# EAGLE design 2bitRegisterBoard (EAGLE 9.2.0)
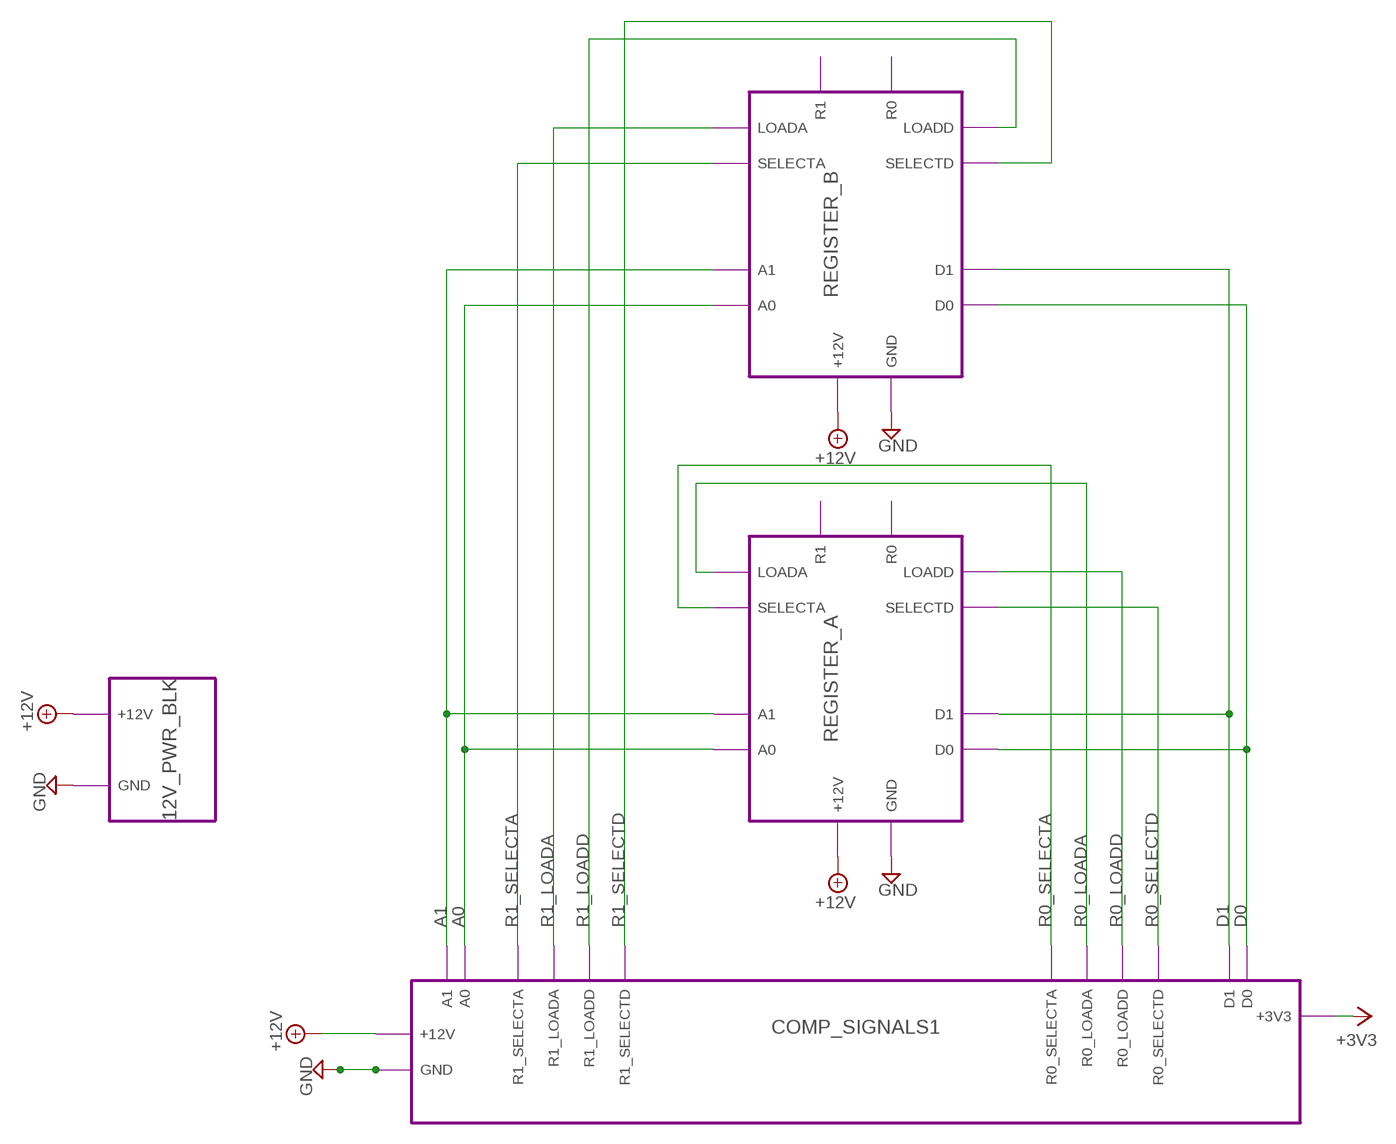
[diagram p0: schematic, sheet 1]

## Module instances
COMP_SIGNALS1 = COMP_SIGNALS
12V_PWR_BLK = 12V_PWR_BLK
REGISTER_A = REGISTER2
REGISTER_B = REGISTER2

## Nets
+3V3 [pwr]: port COMP_SIGNALS1.+3V3
+12V [pwr]: port 12V_PWR_BLK.+12V COMP_SIGNALS1.+12V REGISTER_A.+12V REGISTER_B.+12V
A0: port COMP_SIGNALS1.A0 REGISTER_B.A0 REGISTER_A.A0
A1: port COMP_SIGNALS1.A1 REGISTER_B.A1 REGISTER_A.A1
D0: port COMP_SIGNALS1.D0 REGISTER_B.D0 REGISTER_A.D0
D1: port COMP_SIGNALS1.D1 REGISTER_B.D1 REGISTER_A.D1
GND [pwr]: port 12V_PWR_BLK.GND COMP_SIGNALS1.GND REGISTER_A.GND REGISTER_B.GND
R0_LOADA: port REGISTER_A.LOADA COMP_SIGNALS1.R0_LOADA
R0_LOADD: port COMP_SIGNALS1.R0_LOADD REGISTER_A.LOADD
R0_SELECTA: port COMP_SIGNALS1.R0_SELECTA REGISTER_A.SELECTA
R0_SELECTD: port COMP_SIGNALS1.R0_SELECTD REGISTER_A.SELECTD
R1_LOADA: port COMP_SIGNALS1.R1_LOADA REGISTER_B.LOADA
R1_LOADD: port COMP_SIGNALS1.R1_LOADD REGISTER_B.LOADD
R1_SELECTA: port COMP_SIGNALS1.R1_SELECTA REGISTER_B.SELECTA
R1_SELECTD: port COMP_SIGNALS1.R1_SELECTD REGISTER_B.SELECTD

## Library data of the parts

## Module 3V3_TO_12V_1BIT
Ports: IN(in) OUT(out) +12V(pwr) GND(pwr)
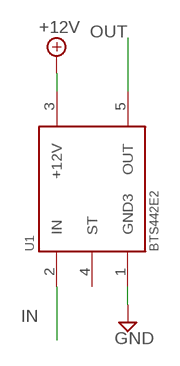
[diagram p1: schematic, module 3V3_TO_12V_1BIT, sheet 1]

### Parts
U1  BTS442E2  [TO170P440X1000X1975-5B]

### Nets
+12V: U1.3(+12V)
GND: U1.1(GND3)
IN: U1.2(IN)
OUT: U1.5(OUT)
Unconnected: U1.4(ST)

### Library data of the parts
U1 = relay_computer_custom:BTS442E2: BTS442E2 Smart High Side Power Switch, VBB 63V, R(ON) 18mOhm TO170P440X1000X1975-5B; MPN: BTS442E2BKSA1; OC_NEWARK: 78X4831

## Module 12V_PWR_BLK
Ports: +12V(pwr) GND(pwr)
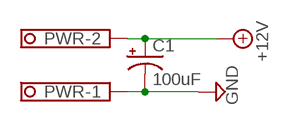
[diagram p2: schematic, module 12V_PWR_BLK, sheet 1]

### Parts
C1  100uF  100UF-POLAR-RADIAL-5MM-50V-20%  [CPOL-RADIAL-5MM-8MM]
PWR  PWR_BLK  [1751248]

### Nets
+12V: C1.1(+) PWR.2
GND: C1.2(-) PWR.1

### Library data of the parts
C1 = relay_computer_custom:100UF-POLAR: 100µF polarized capacitors A capacitor is a passive two-terminal electrical component used to store electrical energy temporarily in an electric field.; PROD_ID: ECA1HM101
PWR = relay_computer_custom:PWR_BLK: MKDS 1/ 2-3,5 Printklemme Nennstrom: 10 A Bemessungsspannung: 160 V Raster: 3,5 mm Polzahl: 2 Montageart: Löten Anschlussart: Schraubanschluss Anschlussrichtung vom Leiter zur Platine: 0° Source: http://eshop.phoenixcontact.com .. 1751248.pdf; OC_FARNELL: unknown; OC_NEWARK: unknown

## Module 12V_TO_3V3_1BIT
Ports: OUT(out) +3V3(pwr) GND(pwr) IN(in)
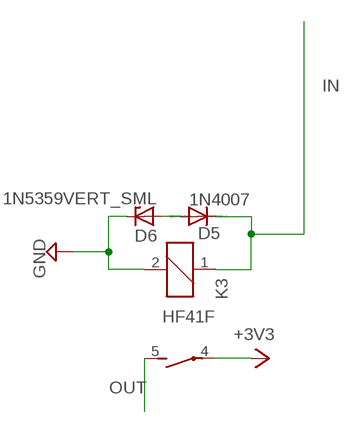
[diagram p3: schematic, module 12V_TO_3V3_1BIT, sheet 1]

### Parts
D5  1N4007  [RAD2,5]
D6  1N5359VERT_SML  [RAD2.5_D2]
K3  HF41F-12-H  [HF41F-12-H]

### Nets
+3V3: K3.4(P)
D$3: D5.A D6.A
GND: D6.C K3.2
IN: D5.C K3.1
OUT: K3.5(S)

### Notes on the sheet
- HF41F

### Library data of the parts
D5 = relay_computer_custom:1N4007: DIODE general purpose rectifier, 1 A; MPN: 1N4007-E3/73; OC_NEWARK: 78K2222
D6 = relay_computer_custom:1N5359: Z DIODE 24 V, 5W; MF: ON SEMICONDUCTOR; MPN: 1N5359BRLG; OC_NEWARK: 42K2893
K3 = relay_computer_custom:HF41F-12-H: SPST RELAY Relay SPST 5mm x 28mm HONGFA; OC_NEWARK: unknown

## Module DUAL_12V⇆3V3_1BIT
Ports: IN3V3(in) OUT3V3(out) +3V3(pwr) GND(pwr) +12V(pwr) 12V_SIGNAL(io)
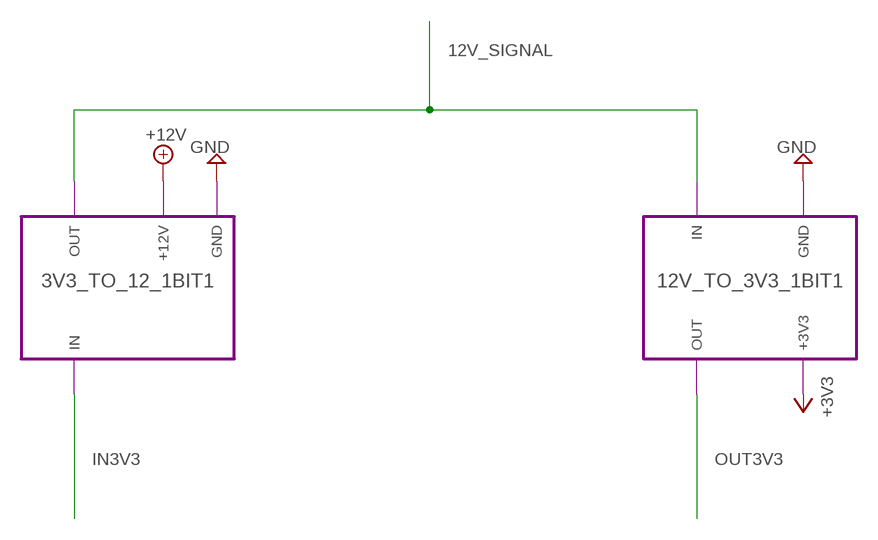
[diagram p4: schematic, module DUAL_12V⇆3V3_1BIT, sheet 1]

### Module instances
3V3_TO_12_1BIT1 = 3V3_TO_12V_1BIT
12V_TO_3V3_1BIT1 = 12V_TO_3V3_1BIT

### Nets
12V_SIGNAL: port 3V3_TO_12_1BIT1.OUT 12V_TO_3V3_1BIT1.IN
+3V3: port 12V_TO_3V3_1BIT1.+3V3
+12V: port 3V3_TO_12_1BIT1.+12V
GND: port 3V3_TO_12_1BIT1.GND 12V_TO_3V3_1BIT1.GND
IN3V3: port 3V3_TO_12_1BIT1.IN
OUT3V3: port 12V_TO_3V3_1BIT1.OUT

### Library data of the parts

## Module I2C_INTERFACE
Ports: +3V3(pwr) OUT3(out) OUT2(out) OUT1(out) OUT0(out) IO_I0(in) IO_O0(out) IO_I1(in) IO_O1(out) IO_I2(in) IO_O2(out) IO_I3(in) IO_O3(out) GND(pwr) OUT4(out) OUT5(out) OUT7(out) OUT6(out)
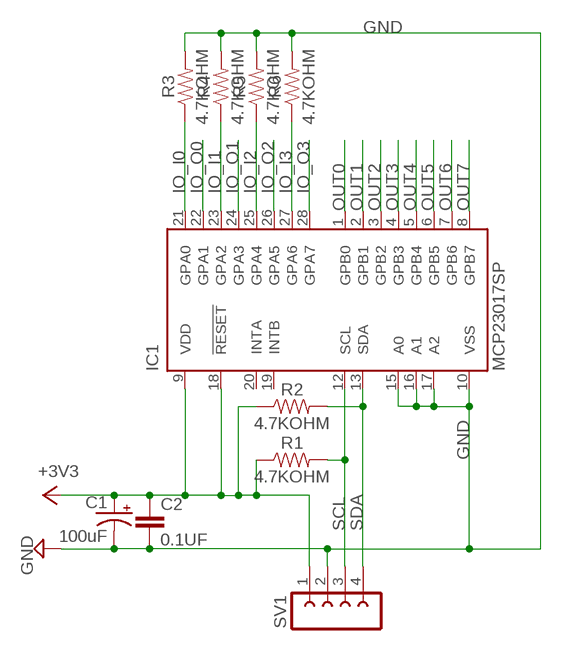
[diagram p5: schematic, module I2C_INTERFACE, sheet 1]

### Parts
C1  100uF  100UF-POLAR-RADIAL-5MM-50V-20%  [CPOL-RADIAL-5MM-8MM]
C2  0.1UF  [VERT_CAP]
IC1  MCP23017SP  [DIL28-3]
R1  4.7KOHM  [RAD2.5_RES]
R2  4.7KOHM  [RAD2.5_RES]
R3  4.7KOHM  [RAD2.5_RES]
R4  4.7KOHM  [RAD2.5_RES]
R5  4.7KOHM  [RAD2.5_RES]
R6  4.7KOHM  [RAD2.5_RES]
SV1  FE04-1  [FE04-1]

### Nets
+3V3: C1.1(+) C2.A IC1.9(VDD) IC1.18(!RESET) R1.A R2.A SV1.1
GND: C1.2(-) C2.C IC1.10(VSS) IC1.15(A0) IC1.16(A1) IC1.17(A2) R3.C R4.C R5.C R6.C SV1.2
IO_I0: IC1.21(GPA0) R3.A
IO_I1: IC1.23(GPA2) R4.A
IO_I2: IC1.25(GPA4) R5.A
IO_I3: IC1.27(GPA6) R6.A
IO_O0: IC1.22(GPA1)
IO_O1: IC1.24(GPA3)
IO_O2: IC1.26(GPA5)
IO_O3: IC1.28(GPA7)
OUT0: IC1.1(GPB0)
OUT1: IC1.2(GPB1)
OUT2: IC1.3(GPB2)
OUT3: IC1.4(GPB3)
OUT4: IC1.5(GPB4)
OUT5: IC1.6(GPB5)
OUT6: IC1.7(GPB6)
OUT7: IC1.8(GPB7)
SCL: IC1.12(SCL) R1.C SV1.3
SDA: IC1.13(SDA) R2.C SV1.4
Unconnected: IC1.19(INTB) IC1.20(INTA)

### Library data of the parts
C1 = relay_computer_custom:100UF-POLAR: 100µF polarized capacitors A capacitor is a passive two-terminal electrical component used to store electrical energy temporarily in an electric field.; PROD_ID: ECA1HM101
C2 = relay_computer_custom:0.1UF: 0.1µF ceramic capacitors A capacitor is a passive two-terminal electrical component used to store electrical energy temporarily in an electric field.
IC1 = relay_computer_custom:MCP23017: http://ww1.microchip.com/downloads/en/DeviceDoc/21952a.pdf Source: http://ww1.microchip.com/downloads/en/DeviceDoc/21952a.pdf
R1-R6 = relay_computer_custom:4.7KOHM: 4.7kΩ resistor A resistor is a passive two-terminal electrical component that implements electrical resistance as a circuit element. Resistors act to reduce current flow, and, at the same time, act to lower voltage levels within circuits. - Wikipedia
SV1 = relay_computer_custom:FE04-1: FEMALE HEADER4 PIN 0.1" Sullins PPPC041LFBN-RC http://www.sullinscorp.com/drawings/78_P(N)PxCxxxLFBN-RC,_10492-H.pdf; MF: Sullins Connector Solutions; MPN: PPPC041LFBN-RC; OC_FARNELL: unknown; OC_NEWARK: unknown

## Module COMP_SIGNALS
Ports: +12V(pwr) GND(pwr) D1(io) D0(io) A1(io) A0(io) R0_SELECTD(io) R0_SELECTA(io) R0_LOADD(io) R0_LOADA(io) R1_LOADA(io) R1_LOADD(io) R1_SELECTA(io) R1_SELECTD(io) +3V3(pwr)
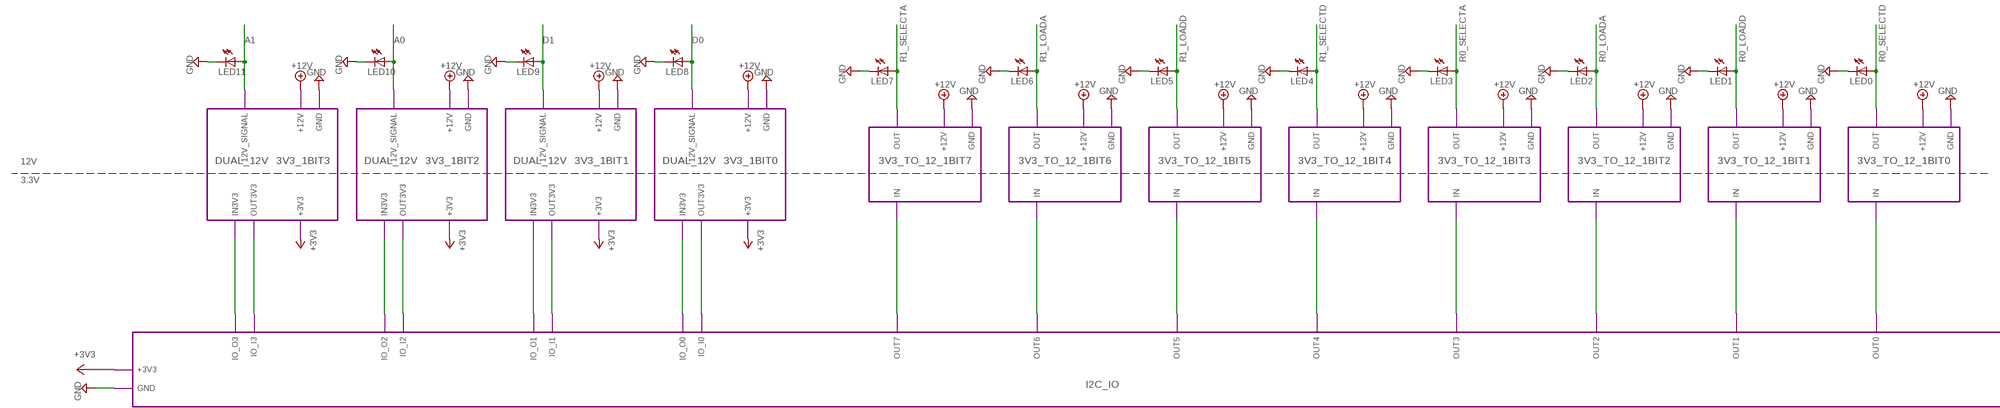
[diagram p6: schematic, module COMP_SIGNALS, sheet 1]

### Parts
LED0  LED3MM  [LED3MM]
LED1  LED3MM  [LED3MM]
LED2  LED3MM  [LED3MM]
LED3  LED3MM  [LED3MM]
LED4  LED3MM  [LED3MM]
LED5  LED3MM  [LED3MM]
LED6  LED3MM  [LED3MM]
LED7  LED3MM  [LED3MM]
LED8  LED3MM  [LED3MM]
LED9  LED3MM  [LED3MM]
LED10  LED3MM  [LED3MM]
LED11  LED3MM  [LED3MM]

### Module instances
DUAL_12V⇆3V3_1BIT3 = DUAL_12V⇆3V3_1BIT
I2C_IO = I2C_INTERFACE
3V3_TO_12_1BIT0 = 3V3_TO_12V_1BIT
3V3_TO_12_1BIT1 = 3V3_TO_12V_1BIT
3V3_TO_12_1BIT2 = 3V3_TO_12V_1BIT
3V3_TO_12_1BIT3 = 3V3_TO_12V_1BIT
3V3_TO_12_1BIT4 = 3V3_TO_12V_1BIT
3V3_TO_12_1BIT5 = 3V3_TO_12V_1BIT
3V3_TO_12_1BIT6 = 3V3_TO_12V_1BIT
3V3_TO_12_1BIT7 = 3V3_TO_12V_1BIT
DUAL_12V⇆3V3_1BIT2 = DUAL_12V⇆3V3_1BIT
DUAL_12V⇆3V3_1BIT1 = DUAL_12V⇆3V3_1BIT
DUAL_12V⇆3V3_1BIT0 = DUAL_12V⇆3V3_1BIT

### Nets
+3V3 [pwr]: port DUAL_12V⇆3V3_1BIT3.+3V3 I2C_IO.+3V3 DUAL_12V⇆3V3_1BIT2.+3V3 DUAL_12V⇆3V3_1BIT1.+3V3 DUAL_12V⇆3V3_1BIT0.+3V3
+12V [pwr]: port DUAL_12V⇆3V3_1BIT3.+12V 3V3_TO_12_1BIT0.+12V 3V3_TO_12_1BIT1.+12V 3V3_TO_12_1BIT2.+12V 3V3_TO_12_1BIT3.+12V 3V3_TO_12_1BIT4.+12V 3V3_TO_12_1BIT5.+12V 3V3_TO_12_1BIT6.+12V 3V3_TO_12_1BIT7.+12V DUAL_12V⇆3V3_1BIT2.+12V DUAL_12V⇆3V3_1BIT1.+12V DUAL_12V⇆3V3_1BIT0.+12V
A0: LED10.A ; port DUAL_12V⇆3V3_1BIT2.12V_SIGNAL
A1: LED11.A ; port DUAL_12V⇆3V3_1BIT3.12V_SIGNAL
D0: LED8.A ; port DUAL_12V⇆3V3_1BIT0.12V_SIGNAL
D1: LED9.A ; port DUAL_12V⇆3V3_1BIT1.12V_SIGNAL
GND [pwr]: LED0.K(C) LED1.K(C) LED2.K(C) LED3.K(C) LED4.K(C) LED5.K(C) LED6.K(C) LED7.K(C) LED8.K(C) LED9.K(C) LED10.K(C) LED11.K(C) ; port DUAL_12V⇆3V3_1BIT3.GND I2C_IO.GND 3V3_TO_12_1BIT0.GND 3V3_TO_12_1BIT1.GND 3V3_TO_12_1BIT2.GND 3V3_TO_12_1BIT3.GND 3V3_TO_12_1BIT4.GND 3V3_TO_12_1BIT5.GND 3V3_TO_12_1BIT6.GND 3V3_TO_12_1BIT7.GND DUAL_12V⇆3V3_1BIT2.GND DUAL_12V⇆3V3_1BIT1.GND DUAL_12V⇆3V3_1BIT0.GND
N$5: port I2C_IO.IO_O3 DUAL_12V⇆3V3_1BIT3.IN3V3
N$6: port I2C_IO.IO_I3 DUAL_12V⇆3V3_1BIT3.OUT3V3
N$7: port I2C_IO.IO_O2 DUAL_12V⇆3V3_1BIT2.IN3V3
N$8: port I2C_IO.IO_I2 DUAL_12V⇆3V3_1BIT2.OUT3V3
N$9: port I2C_IO.IO_O1 DUAL_12V⇆3V3_1BIT1.IN3V3
N$10: port I2C_IO.IO_I1 DUAL_12V⇆3V3_1BIT1.OUT3V3
N$11: port I2C_IO.IO_O0 DUAL_12V⇆3V3_1BIT0.IN3V3
N$12: port I2C_IO.IO_I0 DUAL_12V⇆3V3_1BIT0.OUT3V3
N$13: port I2C_IO.OUT7 3V3_TO_12_1BIT7.IN
N$14: port I2C_IO.OUT6 3V3_TO_12_1BIT6.IN
N$15: port I2C_IO.OUT5 3V3_TO_12_1BIT5.IN
N$16: port I2C_IO.OUT4 3V3_TO_12_1BIT4.IN
N$17: port I2C_IO.OUT3 3V3_TO_12_1BIT3.IN
N$18: port I2C_IO.OUT2 3V3_TO_12_1BIT2.IN
N$19: port I2C_IO.OUT1 3V3_TO_12_1BIT1.IN
N$20: port I2C_IO.OUT0 3V3_TO_12_1BIT0.IN
R0_LOADA: LED2.A ; port 3V3_TO_12_1BIT2.OUT
R0_LOADD: LED1.A ; port 3V3_TO_12_1BIT1.OUT
R0_SELECTA: LED3.A ; port 3V3_TO_12_1BIT3.OUT
R0_SELECTD: LED0.A ; port 3V3_TO_12_1BIT0.OUT
R1_LOADA: LED6.A ; port 3V3_TO_12_1BIT6.OUT
R1_LOADD: LED5.A ; port 3V3_TO_12_1BIT5.OUT
R1_SELECTA: LED7.A ; port 3V3_TO_12_1BIT7.OUT
R1_SELECTD: LED4.A ; port 3V3_TO_12_1BIT4.OUT

### Notes on the sheet
- 12V
- 3.3V

### Library data of the parts
LED0 LED1-LED11 = relay_computer_custom:LED: VCC 12V LED w/ built-in resistor; OC_NEWARK: unknown

## Module ENABLE2
Ports: GND(pwr) ENABLE(in) OUT1(io) OUT0(io) IN1(in) IN0(in)
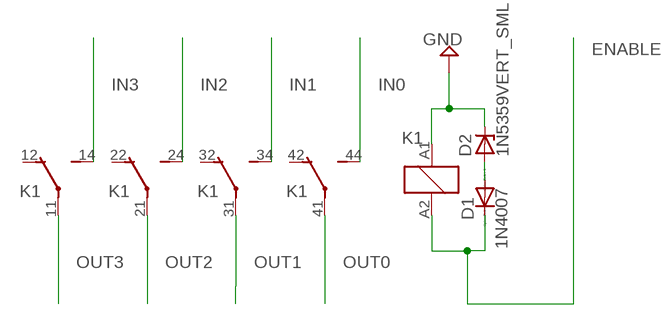
[diagram p7: schematic, module ENABLE2, sheet 1]

### Parts
D1  1N4007  [RAD2,5]
D2  1N5359VERT_SML  [RAD2.5_D2]
K1  PY14-02  [PY14-02]

### Nets
D$1: D1.A D2.A
ENABLE: D1.C K1.A2
GND: D2.C K1.A1
IN0: K1.44(5:S)
IN1: K1.34(4:S)
IN2: K1.24(3:S)
IN3: K1.14(2:S)
OUT0: K1.41(5:P)
OUT1: K1.31(4:P)
OUT2: K1.21(3:P)
OUT3: K1.11(2:P)
Unconnected: K1.12(2:O) K1.22(3:O) K1.32(4:O) K1.42(5:O)

### Library data of the parts
D1 = relay_computer_custom:1N4007: DIODE general purpose rectifier, 1 A
D2 = relay_computer_custom:1N5359: Z DIODE 24 V, 5W
K1 = relay_computer_custom:PY14-02: Miniature Relay OMRON 12VDC 4PDT 3A Relay Relay: MY4DC12 https://octopart.com/my4dc12-omron-13160135 Socket: PY14-02 https://octopart.com/py14-02-omron-113738

## Module REGISTER2
Ports: +12V(pwr) GND(pwr) LOADA(in) SELECTA(in) A1(io) A0(io) D0(io) D1(io) SELECTD(in) LOADD(in) R1(io) R0(io)
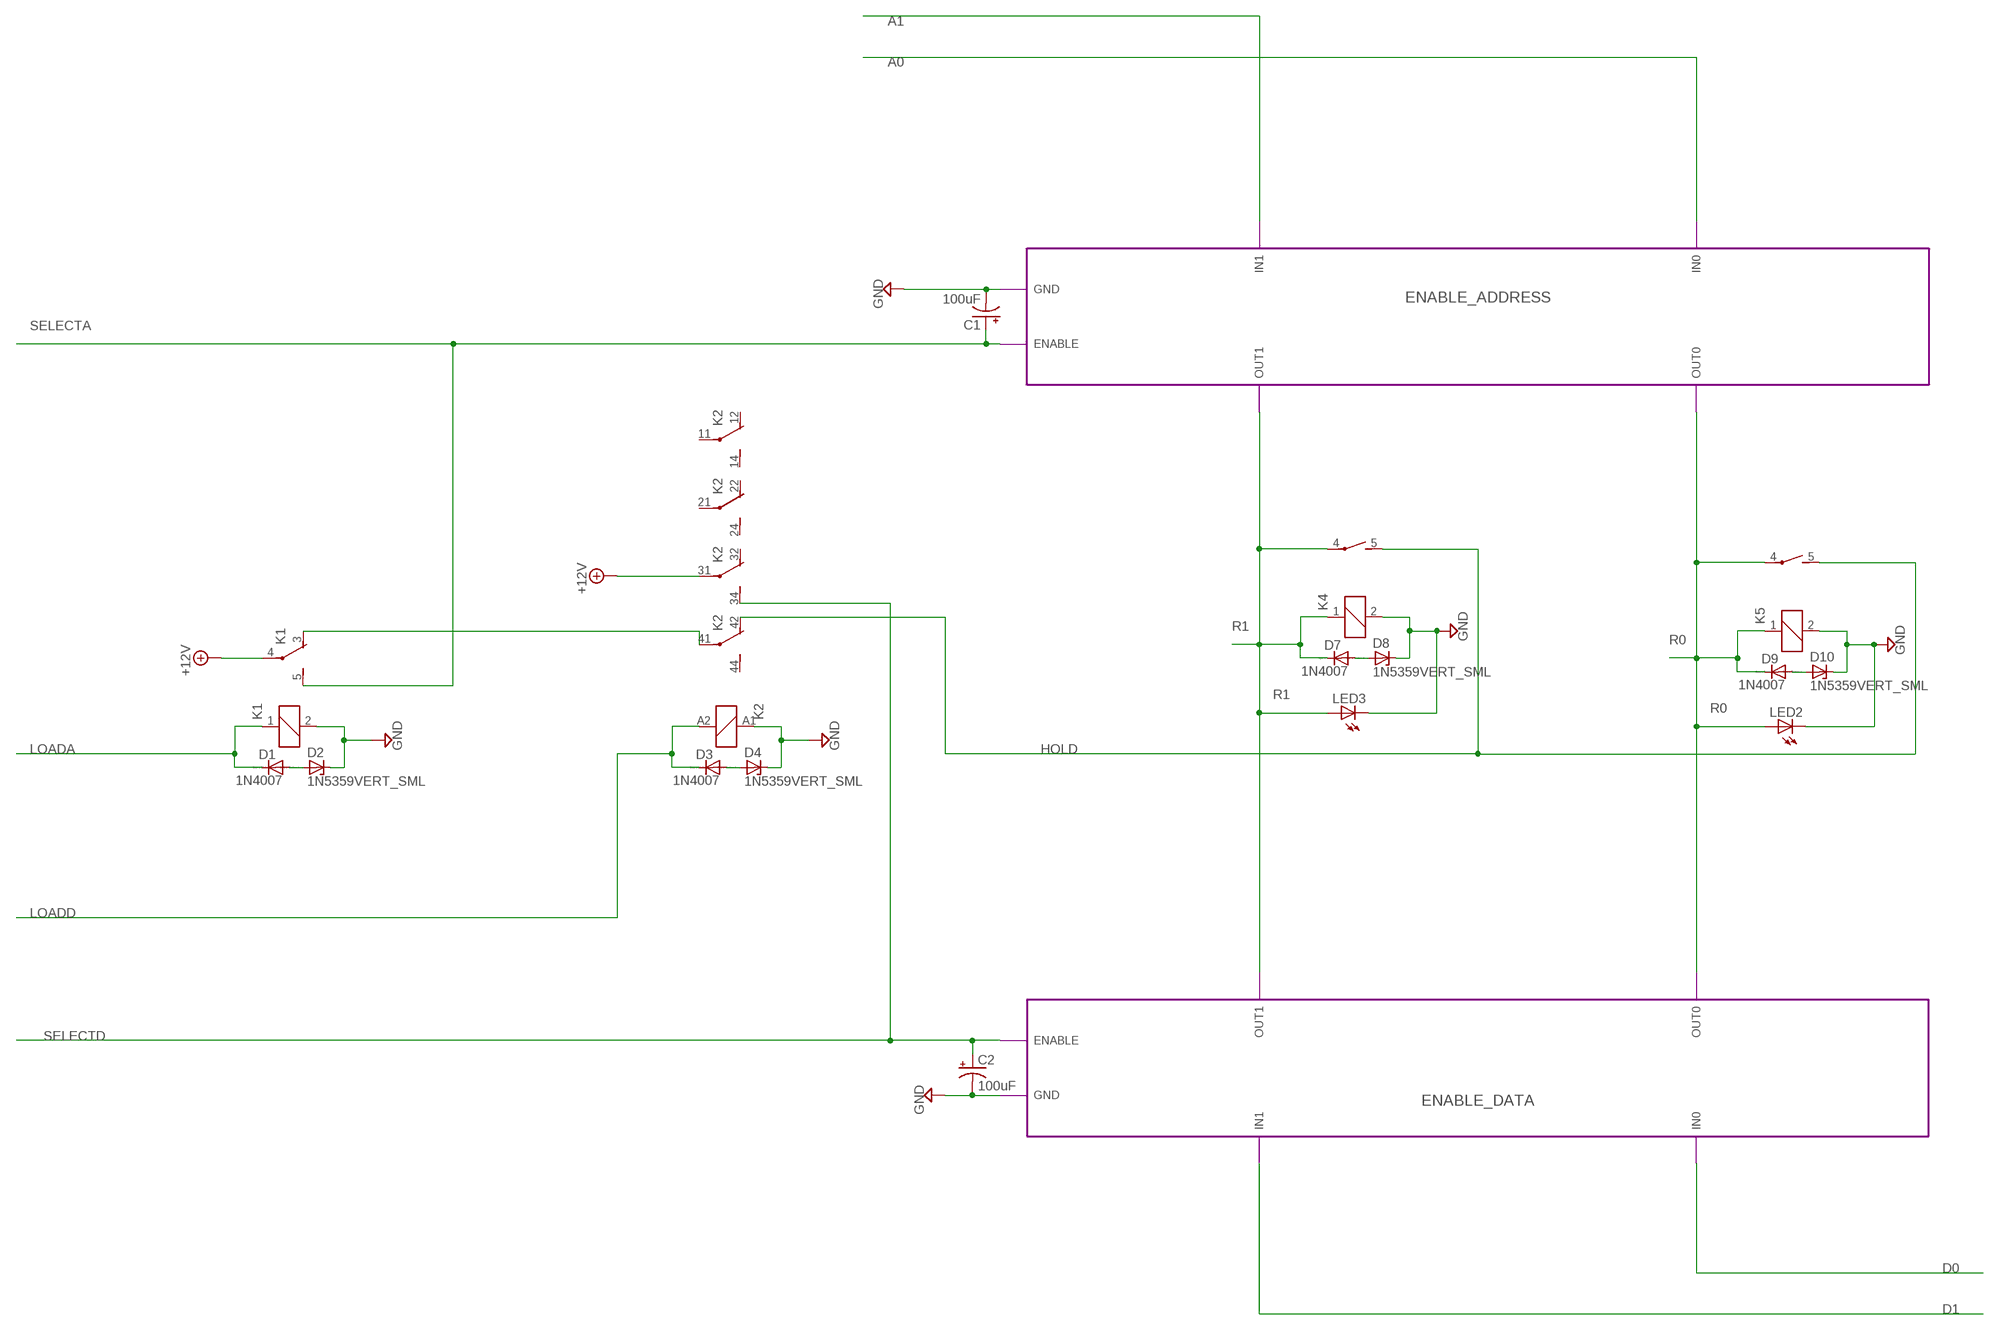
[diagram p8: schematic, module REGISTER2, sheet 1]

### Parts
C1  100uF  100UF-POLAR-RADIAL-5MM-50V-20%  [CPOL-RADIAL-5MM-8MM]
C2  100uF  100UF-POLAR-RADIAL-5MM-50V-20%  [CPOL-RADIAL-5MM-8MM]
D1  1N4007  [RAD2,5]
D2  1N5359VERT_SML  [RAD2.5_D2]
D3  1N4007  [RAD2,5]
D4  1N5359VERT_SML  [RAD2.5_D2]
D7  1N4007  [RAD2,5]
D8  1N5359VERT_SML  [RAD2.5_D2]
D9  1N4007  [RAD2,5]
D10  1N5359VERT_SML  [RAD2.5_D2]
K1  HF41F-12-Z  [HF41F-12-Z]
K2  PY14-02  [PY14-02]
K4  HF41F-12-H  [HF41F-12-H]
K5  HF41F-12-H  [HF41F-12-H]
LED2  LED3MM  [LED3MM]
LED3  LED3MM  [LED3MM]

### Module instances
ENABLE_DATA = ENABLE2
ENABLE_ADDRESS = ENABLE2

### Nets
+12V: K1.4(2:P) K2.31(4:P)
A0: port ENABLE_ADDRESS.IN0
A1: port ENABLE_ADDRESS.IN1
D0: port ENABLE_DATA.IN0
D1: port ENABLE_DATA.IN1
D$1: D1.A D2.A
D$2: D3.A D4.A
D$4: D7.A D8.A
D$5: D9.A D10.A
GND: C1.2(-) C2.2(-) D2.C D4.C D8.C D10.C K1.2 K2.A1 K4.2 K5.2 LED2.K(C) LED3.K(C) ; port ENABLE_ADDRESS.GND ENABLE_DATA.GND
HOLD: K2.42(5:O) K4.5(S) K5.5(S)
LOADA: D1.C K1.1
LOADD: D3.C K2.A2
N$1: K1.3(2:O) K2.41(5:P)
R0: D9.C K5.1 K5.4(P) LED2.A ; port ENABLE_DATA.OUT0 ENABLE_ADDRESS.OUT0
R1: D7.C K4.1 K4.4(P) LED3.A ; port ENABLE_DATA.OUT1 ENABLE_ADDRESS.OUT1
SELECTA: C1.1(+) K1.5(2:S) ; port ENABLE_ADDRESS.ENABLE
SELECTD: C2.1(+) K2.34(4:S) ; port ENABLE_DATA.ENABLE
Unconnected: K2.11(2:P) K2.12(2:O) K2.14(2:S) K2.21(3:P) K2.22(3:O) K2.24(3:S) K2.32(4:O) K2.44(5:S)

### Library data of the parts
C1 C2 = relay_computer_custom:100UF-POLAR: 100µF polarized capacitors A capacitor is a passive two-terminal electrical component used to store electrical energy temporarily in an electric field.; PROD_ID: ECA1HM101
D1 D3 D7 D9 = relay_computer_custom:1N4007: DIODE general purpose rectifier, 1 A
D2 D4 D8 D10 = relay_computer_custom:1N5359: Z DIODE 24 V, 5W
K1 = relay_computer_custom:HF41F-12-Z: SPDT RELAY Relay SPDT 5mm x 28mm HONGFA
K2 = relay_computer_custom:PY14-02: Miniature Relay OMRON 12VDC 4PDT 3A Relay Relay: MY4DC12 https://octopart.com/my4dc12-omron-13160135 Socket: PY14-02 https://octopart.com/py14-02-omron-113738
K4 K5 = relay_computer_custom:HF41F-12-H: SPST RELAY Relay SPST 5mm x 28mm HONGFA
LED2 LED3 = relay_computer_custom:LED: VCC 12V LED w/ built-in resistor

## Net classes
0 default: width 0.508 mm
1 pwr: width 0.635 mm

## Board
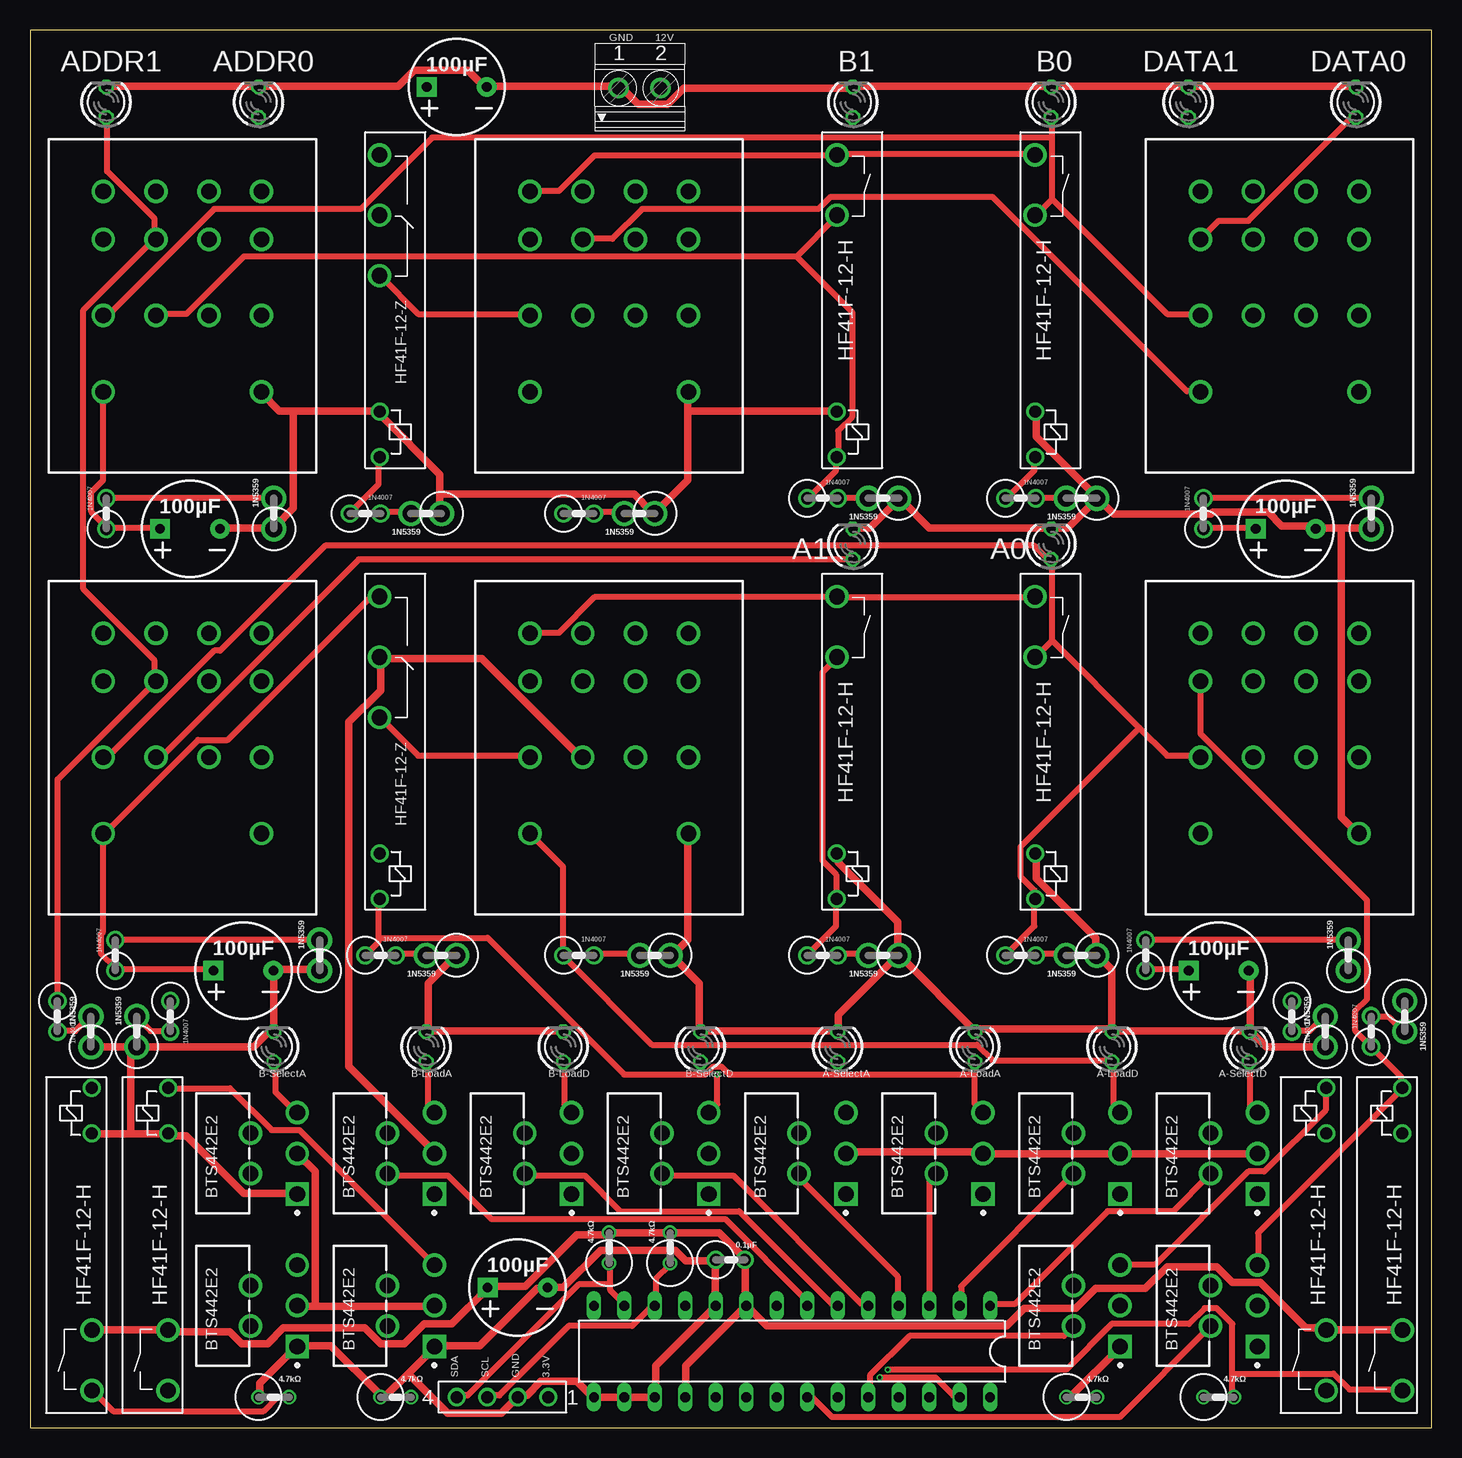
[diagram p9: board, top side]
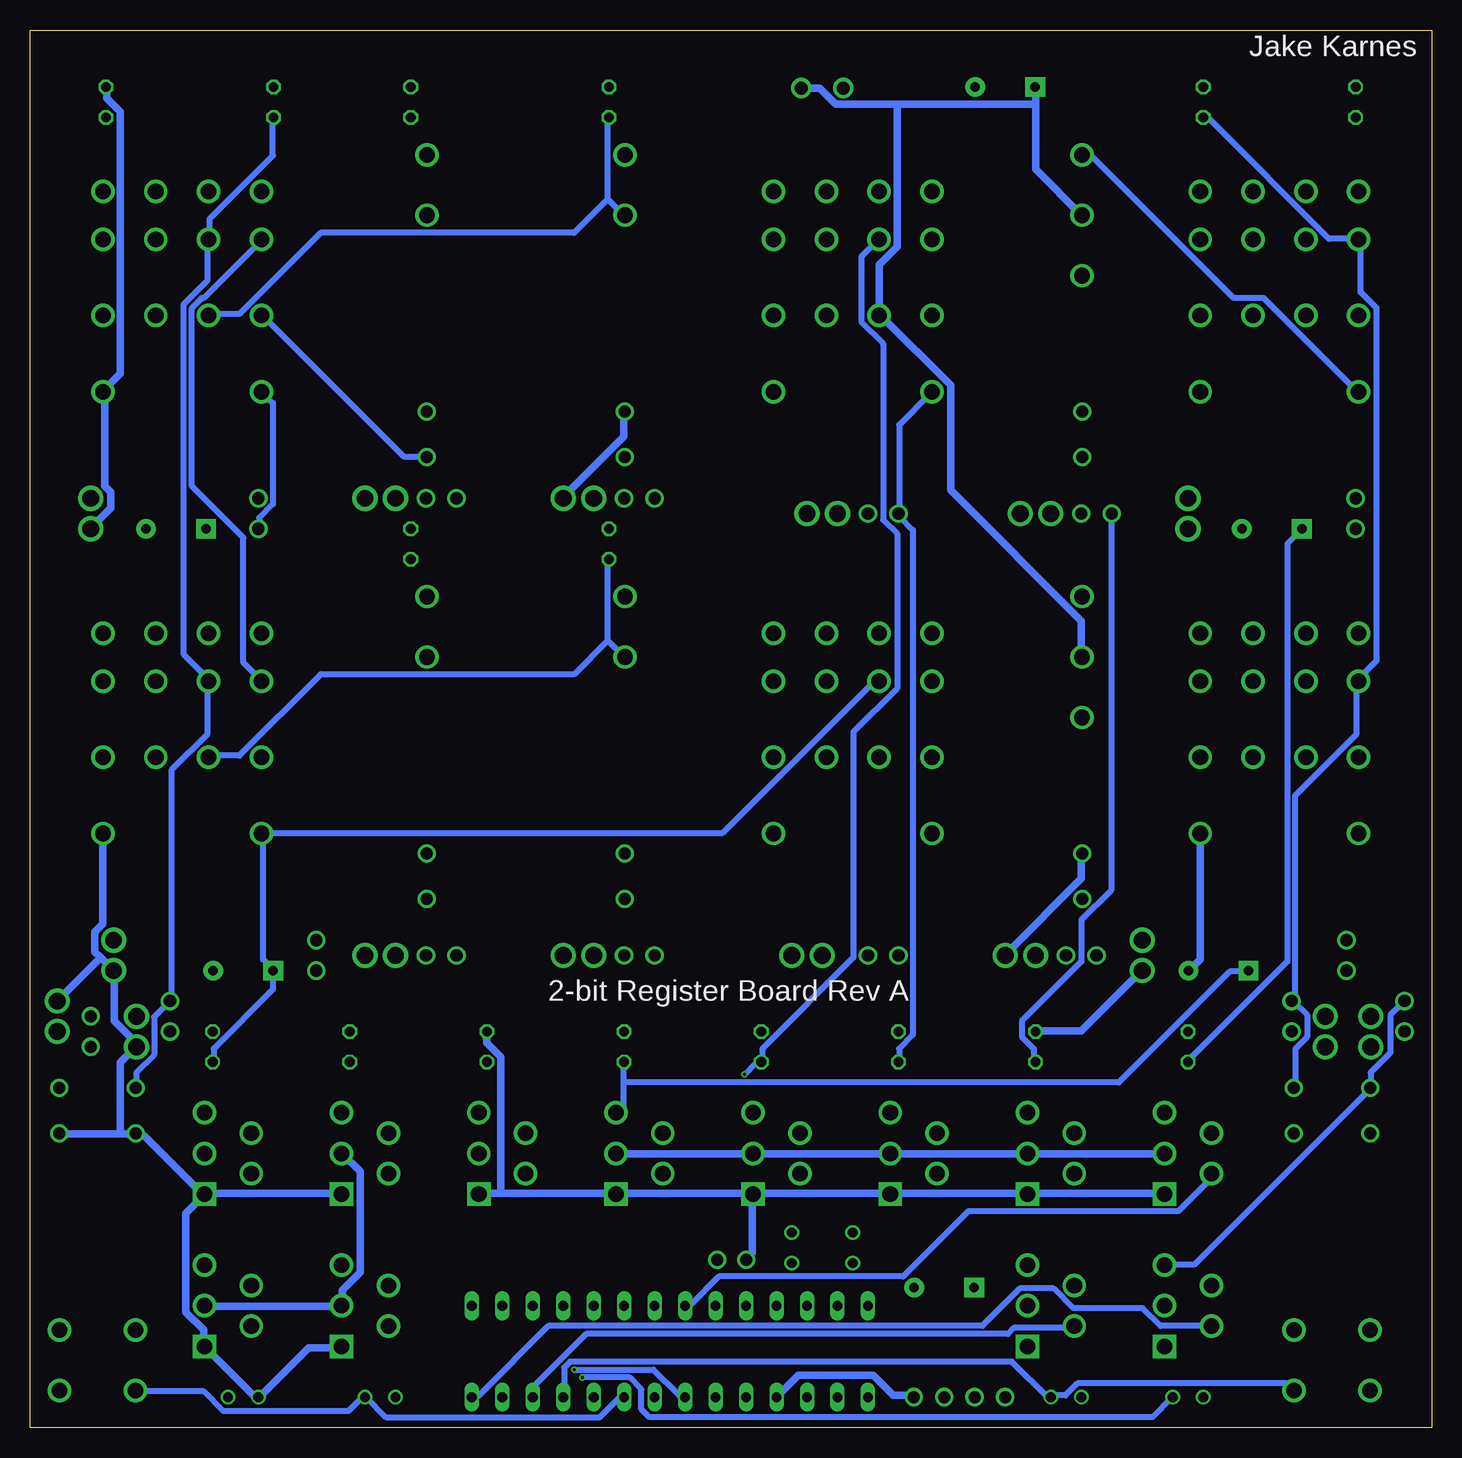
[diagram p10: board, bottom side, seen from below]

Size 116.82 x 116.51 mm. Coordinates in mm from the lower left corner, seen from the top.
Outline: 0,0 116.82,0 116.82,116.51 0,116.51 0,0
Copper layers (1*16): Top 0.035559375mm / dielectric 1.6mm / Bottom 0.035559375mm
Design rules "oshpark-2layer": minimum track width 6mil, minimum drill 10mil, track to track 6mil, track to pad 6mil, pad to pad 6mil, via to via 6mil, smd to smd 6mil, copper to edge 15mil, drill to drill 6mil, minimum pad ring 5mil, minimum via ring 5mil, stop-mask expansion 2.5mil, vias tented up to drill 0mil, thermal gap 10mil

### Footprints (pad centres in the part's own frame; a part is rotated, then mirrored left to right if it is on the bottom)
CPOL-RADIAL-5MM-8MM = drill 0.8 pad 1.651 square: 1 2.5,0 | drill 0.8 pad 1.651: 2 -2.5,0
1751248 = drill 1.1 pad 1.7: 1 -1.75,-0.1; 2 1.75,-0.1
TO170P440X1000X1975-5B = drill 1.3 pad 1.9 square: 1 -1.95,3.4 | drill 1.3 pad 1.9: 2 1.95,1.7; 3 -1.95,0; 4 1.95,-1.7; 5 -1.95,-3.4
RAD2,5 = drill 1.016: A 1.27,0; C -1.27,0
RAD2.5_D2 = drill 1.397: A 1.27,0; C -1.27,0
HF41F-12-H = drill 1: 1 27.04,1.2; 2 23.26,1.2 | drill 1.3: 4 6.88,1.2; 5 1.84,1.2
VERT_CAP = drill 1: A 1.15,0; C -1.27,0
DIL28-3 = drill 0.813 long: 1 -16.51,-3.81; 2 -13.97,-3.81; 3 -11.43,-3.81; 4 -8.89,-3.81; 5 -6.35,-3.81; 6 -3.81,-3.81; 7 -1.27,-3.81; 8 1.27,-3.81; 9 3.81,-3.81; 10 6.35,-3.81; 11 8.89,-3.81; 12 11.43,-3.81; 13 13.97,-3.81; 14 16.51,-3.81; 15 16.51,3.81; 16 13.97,3.81; 17 11.43,3.81; 18 8.89,3.81; 19 6.35,3.81; 20 3.81,3.81; 21 1.27,3.81; 22 -1.27,3.81; 23 -3.81,3.81; 24 -6.35,3.81; 25 -8.89,3.81; 26 -11.43,3.81; 27 -13.97,3.81; 28 -16.51,3.81
RAD2.5_RES = drill 0.813: A 1.27,0; C -1.27,0
FE04-1 = drill 1.016: 1 -3.81,0; 2 -1.27,0; 3 1.27,0; 4 3.81,0
LED3MM = drill 0.813 octagon: A -1.27,0; K 1.27,0
PY14-02 = drill 1.3: 11 6.6,6.35; 12 6.6,16.7; 14 6.6,12.7; 21 2.2,6.35; 22 2.2,16.7; 24 2.2,12.7; 31 -2.2,6.35; 32 -2.2,16.7; 34 -2.2,12.7; 41 -6.6,6.35; 42 -6.6,16.7; 44 -6.6,12.7; A1 6.6,0; A2 -6.6,0
HF41F-12-Z = drill 1: 1 27.04,1.2; 2 23.26,1.2 | drill 1.3: 3 11.92,1.2; 4 6.88,1.2; 5 1.84,1.2

### Placement (x,y rotation side)
12V_PWR_BLK:C1  100uF  [CPOL-RADIAL-5MM-8MM]  35.56,111.76 180 top
12V_PWR_BLK:PWR  PWR_BLK  [1751248]  50.8,111.76 0 top
COMP_SIGNALS1:3V3_TO_12_1BIT0:U1  BTS442E2  [TO170P440X1000X1975-5B]  100.33,22.86 180 top
COMP_SIGNALS1:3V3_TO_12_1BIT1:U1  BTS442E2  [TO170P440X1000X1975-5B]  88.9,22.86 180 top
COMP_SIGNALS1:3V3_TO_12_1BIT2:U1  BTS442E2  [TO170P440X1000X1975-5B]  77.47,22.86 180 top
COMP_SIGNALS1:3V3_TO_12_1BIT3:U1  BTS442E2  [TO170P440X1000X1975-5B]  66.04,22.86 180 top
COMP_SIGNALS1:3V3_TO_12_1BIT4:U1  BTS442E2  [TO170P440X1000X1975-5B]  54.61,22.86 180 top
COMP_SIGNALS1:3V3_TO_12_1BIT5:U1  BTS442E2  [TO170P440X1000X1975-5B]  43.18,22.86 180 top
COMP_SIGNALS1:3V3_TO_12_1BIT6:U1  BTS442E2  [TO170P440X1000X1975-5B]  31.75,22.86 180 top
COMP_SIGNALS1:3V3_TO_12_1BIT7:U1  BTS442E2  [TO170P440X1000X1975-5B]  20.32,22.86 180 top
COMP_SIGNALS1:DUAL_12V⇆3V3_1BIT0:3V3_TO_12_1BIT1:U1  BTS442E2  [TO170P440X1000X1975-5B]  100.33,10.16 180 top
COMP_SIGNALS1:DUAL_12V⇆3V3_1BIT0:12V_TO_3V3_1BIT1:D5  1N4007  [RAD2,5]  111.76,33.02 90 top
COMP_SIGNALS1:DUAL_12V⇆3V3_1BIT0:12V_TO_3V3_1BIT1:D6  1N5359VERT_SML  [RAD2.5_D2]  114.55,34.29 270 top
COMP_SIGNALS1:DUAL_12V⇆3V3_1BIT0:12V_TO_3V3_1BIT1:K3  HF41F-12-H  [HF41F-12-H]  115.57,1.27 90 top
COMP_SIGNALS1:DUAL_12V⇆3V3_1BIT1:3V3_TO_12_1BIT1:U1  BTS442E2  [TO170P440X1000X1975-5B]  88.9,10.16 180 top
COMP_SIGNALS1:DUAL_12V⇆3V3_1BIT1:12V_TO_3V3_1BIT1:D5  1N4007  [RAD2,5]  105.16,34.29 270 top
COMP_SIGNALS1:DUAL_12V⇆3V3_1BIT1:12V_TO_3V3_1BIT1:D6  1N5359VERT_SML  [RAD2.5_D2]  107.95,33.02 90 top
COMP_SIGNALS1:DUAL_12V⇆3V3_1BIT1:12V_TO_3V3_1BIT1:K3  HF41F-12-H  [HF41F-12-H]  109.22,1.27 90 top
COMP_SIGNALS1:DUAL_12V⇆3V3_1BIT2:3V3_TO_12_1BIT1:U1  BTS442E2  [TO170P440X1000X1975-5B]  31.75,10.16 180 top
COMP_SIGNALS1:DUAL_12V⇆3V3_1BIT2:12V_TO_3V3_1BIT1:D5  1N4007  [RAD2,5]  11.68,34.29 270 top
COMP_SIGNALS1:DUAL_12V⇆3V3_1BIT2:12V_TO_3V3_1BIT1:D6  1N5359VERT_SML  [RAD2.5_D2]  8.89,33.02 90 top
COMP_SIGNALS1:DUAL_12V⇆3V3_1BIT2:12V_TO_3V3_1BIT1:K3  HF41F-12-H  [HF41F-12-H]  12.7,1.27 90 top
COMP_SIGNALS1:DUAL_12V⇆3V3_1BIT3:3V3_TO_12_1BIT1:U1  BTS442E2  [TO170P440X1000X1975-5B]  20.32,10.16 180 top
COMP_SIGNALS1:DUAL_12V⇆3V3_1BIT3:12V_TO_3V3_1BIT1:D5  1N4007  [RAD2,5]  2.29,34.29 270 top
COMP_SIGNALS1:DUAL_12V⇆3V3_1BIT3:12V_TO_3V3_1BIT1:D6  1N5359VERT_SML  [RAD2.5_D2]  5.08,33.02 90 top
COMP_SIGNALS1:DUAL_12V⇆3V3_1BIT3:12V_TO_3V3_1BIT1:K3  HF41F-12-H  [HF41F-12-H]  6.35,1.27 90 top
COMP_SIGNALS1:I2C_IO:C1  100uF  [CPOL-RADIAL-5MM-8MM]  40.64,11.68 180 top
COMP_SIGNALS1:I2C_IO:C2  0.1UF  [VERT_CAP]  58.42,13.97 0 top
COMP_SIGNALS1:I2C_IO:IC1  MCP23017SP  [DIL28-3]  63.5,6.35 180 top
COMP_SIGNALS1:I2C_IO:R1  4.7KOHM  [RAD2.5_RES]  53.34,14.99 90 top
COMP_SIGNALS1:I2C_IO:R2  4.7KOHM  [RAD2.5_RES]  48.26,14.99 90 top
COMP_SIGNALS1:I2C_IO:R3  4.7KOHM  [RAD2.5_RES]  99.06,2.54 0 top
COMP_SIGNALS1:I2C_IO:R4  4.7KOHM  [RAD2.5_RES]  87.63,2.54 0 top
COMP_SIGNALS1:I2C_IO:R5  4.7KOHM  [RAD2.5_RES]  30.48,2.54 0 top
COMP_SIGNALS1:I2C_IO:R6  4.7KOHM  [RAD2.5_RES]  20.32,2.54 0 top
COMP_SIGNALS1:I2C_IO:SV1  [FE04-1]  39.37,2.54 180 top
COMP_SIGNALS1:LED0  [LED3MM]  101.6,31.75 90 top
COMP_SIGNALS1:LED1  [LED3MM]  90.17,31.75 90 top
COMP_SIGNALS1:LED2  [LED3MM]  78.74,31.75 90 top
COMP_SIGNALS1:LED3  [LED3MM]  67.31,31.75 90 top
COMP_SIGNALS1:LED4  [LED3MM]  55.88,31.75 90 top
COMP_SIGNALS1:LED5  [LED3MM]  44.45,31.75 90 top
COMP_SIGNALS1:LED6  [LED3MM]  33.02,31.75 90 top
COMP_SIGNALS1:LED7  [LED3MM]  20.32,31.75 90 top
COMP_SIGNALS1:LED8  [LED3MM]  110.49,110.49 90 top
COMP_SIGNALS1:LED9  [LED3MM]  96.52,110.49 90 top
COMP_SIGNALS1:LED10  [LED3MM]  19.05,110.49 90 top
COMP_SIGNALS1:LED11  [LED3MM]  6.35,110.49 90 top
REGISTER_A:C1  100uF  [CPOL-RADIAL-5MM-8MM]  17.78,38.1 180 top
REGISTER_A:C2  100uF  [CPOL-RADIAL-5MM-8MM]  99.06,38.1 180 top
REGISTER_A:D1  1N4007  [RAD2,5]  29.21,39.37 0 top
REGISTER_A:D2  1N5359VERT_SML  [RAD2.5_D2]  34.29,39.37 180 top
REGISTER_A:D3  1N4007  [RAD2,5]  45.72,39.37 0 top
REGISTER_A:D4  1N5359VERT_SML  [RAD2.5_D2]  52.07,39.37 180 top
REGISTER_A:D7  1N4007  [RAD2,5]  66.04,39.37 0 top
REGISTER_A:D8  1N5359VERT_SML  [RAD2.5_D2]  71.12,39.37 180 top
REGISTER_A:D9  1N4007  [RAD2,5]  82.55,39.37 0 top
REGISTER_A:D10  1N5359VERT_SML  [RAD2.5_D2]  87.63,39.37 180 top
REGISTER_A:ENABLE_ADDRESS:D1  1N4007  [RAD2,5]  7.11,39.37 90 top
REGISTER_A:ENABLE_ADDRESS:D2  1N5359VERT_SML  [RAD2.5_D2]  24.13,39.37 90 top
REGISTER_A:ENABLE_ADDRESS:K1  PY14-02  [PY14-02]  12.7,49.53 0 top
REGISTER_A:ENABLE_DATA:D1  1N4007  [RAD2,5]  92.96,39.37 90 top
REGISTER_A:ENABLE_DATA:D2  1N5359VERT_SML  [RAD2.5_D2]  109.86,39.37 90 top
REGISTER_A:ENABLE_DATA:K1  PY14-02  [PY14-02]  104.14,49.53 0 top
REGISTER_A:K1  HF41F-12-Z  [HF41F-12-Z]  27.94,71.12 270 top
REGISTER_A:K2  PY14-02  [PY14-02]  48.26,49.53 0 top
REGISTER_A:K4  HF41F-12-H  [HF41F-12-H]  66.04,71.12 270 top
REGISTER_A:K5  HF41F-12-H  [HF41F-12-H]  82.55,71.12 270 top
REGISTER_A:LED2  [LED3MM]  85.09,73.66 90 top
REGISTER_A:LED3  [LED3MM]  68.58,73.66 90 top
REGISTER_B:C1  100uF  [CPOL-RADIAL-5MM-8MM]  13.33,74.93 180 top
REGISTER_B:C2  100uF  [CPOL-RADIAL-5MM-8MM]  104.65,74.93 180 top
REGISTER_B:D1  1N4007  [RAD2,5]  27.94,76.2 0 top
REGISTER_B:D2  1N5359VERT_SML  [RAD2.5_D2]  33.02,76.2 180 top
REGISTER_B:D3  1N4007  [RAD2,5]  45.72,76.2 0 top
REGISTER_B:D4  1N5359VERT_SML  [RAD2.5_D2]  50.8,76.2 180 top
REGISTER_B:D7  1N4007  [RAD2,5]  66.04,77.47 0 top
REGISTER_B:D8  1N5359VERT_SML  [RAD2.5_D2]  71.12,77.47 180 top
REGISTER_B:D9  1N4007  [RAD2,5]  82.55,77.47 0 top
REGISTER_B:D10  1N5359VERT_SML  [RAD2.5_D2]  87.63,77.47 180 top
REGISTER_B:ENABLE_ADDRESS:D1  1N4007  [RAD2,5]  6.35,76.2 90 top
REGISTER_B:ENABLE_ADDRESS:D2  1N5359VERT_SML  [RAD2.5_D2]  20.32,76.2 90 top
REGISTER_B:ENABLE_ADDRESS:K1  PY14-02  [PY14-02]  12.7,86.36 0 top
REGISTER_B:ENABLE_DATA:D1  1N4007  [RAD2,5]  97.79,76.2 90 top
REGISTER_B:ENABLE_DATA:D2  1N5359VERT_SML  [RAD2.5_D2]  111.76,76.2 90 top
REGISTER_B:ENABLE_DATA:K1  PY14-02  [PY14-02]  104.14,86.36 0 top
REGISTER_B:K1  HF41F-12-Z  [HF41F-12-Z]  27.94,107.95 270 top
REGISTER_B:K2  PY14-02  [PY14-02]  48.26,86.36 0 top
REGISTER_B:K4  HF41F-12-H  [HF41F-12-H]  66.04,107.95 270 top
REGISTER_B:K5  HF41F-12-H  [HF41F-12-H]  82.55,107.95 270 top
REGISTER_B:LED2  [LED3MM]  85.09,110.49 90 top
REGISTER_B:LED3  [LED3MM]  68.58,110.49 90 top

### Tracks (layer width: path | path; a pad name or v marks a point on that pad's centre or on a via)
+3V3
  Top 0.635: COMP_SIGNALS1:DUAL_12V⇆3V3_1BIT3:12V_TO_3V3_1BIT1:K3.4 5.27,8.14 11.38,8.14 COMP_SIGNALS1:DUAL_12V⇆3V3_1BIT2:12V_TO_3V3_1BIT1:K3.4 11.71,7.98 16.66,7.98 17.65,6.99 19.8,6.99 21.12,8.31 27.89,8.31 29.21,6.99 31.19,6.99 32.84,8.64 35.15,8.64 37.96,11.44 COMP_SIGNALS1:I2C_IO:C1.1 38.29,11.77 41.26,11.77 45.55,16.07 48.03,16.07 COMP_SIGNALS1:I2C_IO:R2.A 48.36,16.23 53.31,16.23 COMP_SIGNALS1:I2C_IO:R1.A 53.64,16.23 57.44,16.23 59.42,14.25 COMP_SIGNALS1:I2C_IO:C2.A 59.59,13.92 59.59,10.45 COMP_SIGNALS1:I2C_IO:IC1.9 | COMP_SIGNALS1:DUAL_12V⇆3V3_1BIT0:12V_TO_3V3_1BIT1:K3.4 114.24,8.14 108.13,8.14 COMP_SIGNALS1:DUAL_12V⇆3V3_1BIT1:12V_TO_3V3_1BIT1:K3.4 107.8,8.31 106.31,8.31 102.51,12.1 100.2,12.1 98.88,13.42 94.75,13.42 92.94,11.61 88.81,11.61 87.16,9.96 82.87,9.96 81.38,8.47 61.41,8.47 59.92,9.96 COMP_SIGNALS1:I2C_IO:IC1.9 | COMP_SIGNALS1:I2C_IO:IC1.18 54.63,2.69 54.63,5.17 59.59,10.12 COMP_SIGNALS1:I2C_IO:IC1.9
  Bottom 0.635: COMP_SIGNALS1:I2C_IO:SV1.1 43.24,2.69 44.89,2.69 46.54,4.34 52.82,4.34 54.47,2.69 COMP_SIGNALS1:I2C_IO:IC1.18
+12V
  Top 0.635: REGISTER_A:K2.31 46.05,56.02 45.72,56.02 37.63,64.11 29.21,64.11 REGISTER_A:K1.4 29.21,63.78 29.21,61.47 26.57,58.83 26.57,30.1 33.67,23 COMP_SIGNALS1:3V3_TO_12_1BIT6:U1.3 | COMP_SIGNALS1:3V3_TO_12_1BIT0:U1.3 102.18,22.84 91.12,22.84 COMP_SIGNALS1:3V3_TO_12_1BIT1:U1.3 90.79,22.84 79.57,22.84 COMP_SIGNALS1:3V3_TO_12_1BIT2:U1.3 79.23,23 68.01,23 COMP_SIGNALS1:3V3_TO_12_1BIT3:U1.3 | 23.76,10.12 33.67,10.12 COMP_SIGNALS1:DUAL_12V⇆3V3_1BIT2:3V3_TO_12_1BIT1:U1.3 | 23.76,10.12 22.28,10.12 COMP_SIGNALS1:DUAL_12V⇆3V3_1BIT3:3V3_TO_12_1BIT1:U1.3 | 23.76,10.12 23.76,21.35 22.28,22.84 COMP_SIGNALS1:3V3_TO_12_1BIT7:U1.3
  Bottom 0.635: 33.01,110.34 33.01,104.89 29.21,101.09 REGISTER_B:K1.4 | 33.01,110.34 33.01,111.66 12V_PWR_BLK:C1.1 | 33.01,110.34 44.56,110.34 | 44.56,110.34 49.68,110.34 51,111.66 52.49,111.66 12V_PWR_BLK:PWR.2 | 44.56,110.34 44.56,98.45 46.05,96.96 46.05,92.84 REGISTER_B:K2.31 45.88,92.67 40.11,86.89 40.11,78.14 29.21,67.25 29.21,64.28 REGISTER_A:K1.4 | COMP_SIGNALS1:DUAL_12V⇆3V3_1BIT0:3V3_TO_12_1BIT1:U1.3 102.18,10.12 90.96,10.12 COMP_SIGNALS1:DUAL_12V⇆3V3_1BIT1:3V3_TO_12_1BIT1:U1.3 90.79,10.45 90.79,11.44 89.31,12.93 89.31,21.35 90.79,22.84 COMP_SIGNALS1:3V3_TO_12_1BIT1:U1.3 | COMP_SIGNALS1:3V3_TO_12_1BIT7:U1.3 22.28,22.84 33.67,22.84 COMP_SIGNALS1:3V3_TO_12_1BIT6:U1.3 34,22.84 45.06,22.84 COMP_SIGNALS1:3V3_TO_12_1BIT5:U1.3 45.39,22.84 56.45,22.84 COMP_SIGNALS1:3V3_TO_12_1BIT4:U1.3 56.78,22.84 67.84,22.84 COMP_SIGNALS1:3V3_TO_12_1BIT3:U1.3
A0
  Top 0.508: COMP_SIGNALS1:DUAL_12V⇆3V3_1BIT2:3V3_TO_12_1BIT1:U1.5 33.67,13.59 22.44,24.82 20.13,24.82 16.66,28.28 11.54,28.28 COMP_SIGNALS1:DUAL_12V⇆3V3_1BIT2:12V_TO_3V3_1BIT1:K3.1
  Bottom 0.508: COMP_SIGNALS1:LED10.A 18.97,109.18 18.64,109.18 8.57,99.11 6.26,99.11 REGISTER_B:ENABLE_ADDRESS:K1.44 5.93,98.95 5.93,94.65 4.61,93.33 4.61,63.95 6.1,62.46 REGISTER_A:ENABLE_ADDRESS:K1.44 6.26,62.13 6.26,57.84 11.38,52.72 11.38,35.71 COMP_SIGNALS1:DUAL_12V⇆3V3_1BIT2:12V_TO_3V3_1BIT1:D5.C 11.54,35.55 10.39,34.39 10.39,32.58 11.38,31.58 11.38,28.45 COMP_SIGNALS1:DUAL_12V⇆3V3_1BIT2:12V_TO_3V3_1BIT1:K3.1
A1
  Top 0.508: COMP_SIGNALS1:LED11.A 6.43,109.18 6.43,104.72 10.39,100.76 10.39,99.11 REGISTER_B:ENABLE_ADDRESS:K1.34 10.22,98.95 4.45,93.17 4.45,69.89 10.39,63.95 10.39,62.46 REGISTER_A:ENABLE_ADDRESS:K1.34 10.39,62.13 2.3,54.04 2.3,35.71 COMP_SIGNALS1:DUAL_12V⇆3V3_1BIT3:12V_TO_3V3_1BIT1:D5.C
  Bottom 0.508: COMP_SIGNALS1:DUAL_12V⇆3V3_1BIT3:12V_TO_3V3_1BIT1:D5.C 3.45,34.39 3.45,31.25 5.1,29.6 5.1,28.45 COMP_SIGNALS1:DUAL_12V⇆3V3_1BIT3:12V_TO_3V3_1BIT1:K3.1 5.27,28.12 19.8,13.59 22.11,13.59 COMP_SIGNALS1:DUAL_12V⇆3V3_1BIT3:3V3_TO_12_1BIT1:U1.5
COMP_SIGNALS1:DUAL_12V⇆3V3_1BIT0:12V_TO_3V3_1BIT1:D$3
  Top 0.508: COMP_SIGNALS1:DUAL_12V⇆3V3_1BIT0:12V_TO_3V3_1BIT1:D5.A 111.76,34.23 113.25,34.23 114.4,33.07 COMP_SIGNALS1:DUAL_12V⇆3V3_1BIT0:12V_TO_3V3_1BIT1:D6.A
COMP_SIGNALS1:DUAL_12V⇆3V3_1BIT1:12V_TO_3V3_1BIT1:D$3
  Top 0.508: COMP_SIGNALS1:DUAL_12V⇆3V3_1BIT1:12V_TO_3V3_1BIT1:D5.A 105.16,33.07 106.64,33.07 107.8,34.23 COMP_SIGNALS1:DUAL_12V⇆3V3_1BIT1:12V_TO_3V3_1BIT1:D6.A
COMP_SIGNALS1:DUAL_12V⇆3V3_1BIT2:12V_TO_3V3_1BIT1:D$3
  Top 0.508: COMP_SIGNALS1:DUAL_12V⇆3V3_1BIT2:12V_TO_3V3_1BIT1:D5.A 11.54,33.07 10.06,33.07 8.9,34.23 COMP_SIGNALS1:DUAL_12V⇆3V3_1BIT2:12V_TO_3V3_1BIT1:D6.A
COMP_SIGNALS1:DUAL_12V⇆3V3_1BIT3:12V_TO_3V3_1BIT1:D$3
  Top 0.508: COMP_SIGNALS1:DUAL_12V⇆3V3_1BIT3:12V_TO_3V3_1BIT1:D5.A 2.3,33.07 3.78,33.07 4.94,34.23 COMP_SIGNALS1:DUAL_12V⇆3V3_1BIT3:12V_TO_3V3_1BIT1:D6.A
COMP_SIGNALS1:I2C_IO:SCL
  Top 0.508: COMP_SIGNALS1:I2C_IO:R1.C 53.31,13.59 52.16,12.43 52.16,10.29 COMP_SIGNALS1:I2C_IO:IC1.12 51.83,10.12 50.18,8.47 44.89,8.47 39.12,2.69 38.12,2.69 COMP_SIGNALS1:I2C_IO:SV1.3
COMP_SIGNALS1:I2C_IO:SDA
  Top 0.508: 48.36,11.94 48.36,11.44 49.52,10.29 COMP_SIGNALS1:I2C_IO:IC1.13 | 48.36,11.94 48.36,13.59 COMP_SIGNALS1:I2C_IO:R2.C | 48.36,11.94 45.72,11.94 36.47,2.69 35.65,2.69 COMP_SIGNALS1:I2C_IO:SV1.4
COMP_SIGNALS1:N$5
  Bottom 0.508: COMP_SIGNALS1:I2C_IO:IC1.28 79.9,2.69 79.4,2.69 73.62,8.47 37.46,8.47 34.33,11.61 31.52,11.61 29.87,9.96 24.09,9.96 22.61,8.47 18.48,8.47 COMP_SIGNALS1:DUAL_12V⇆3V3_1BIT3:3V3_TO_12_1BIT1:U1.2
COMP_SIGNALS1:N$6  (via drill 0.25)
  Top 0.508: COMP_SIGNALS1:I2C_IO:R6.A 21.45,2.53 20.62,2.53 19.47,1.37 6.92,1.37 5.27,3.02 COMP_SIGNALS1:DUAL_12V⇆3V3_1BIT3:12V_TO_3V3_1BIT1:K3.5 | v70.81,4.18 75.44,4.18 76.92,2.69 77.42,2.69 COMP_SIGNALS1:I2C_IO:IC1.27
  Bottom 0.508: v70.81,4.18 66.85,4.18 65.86,3.19 65.86,1.54 65.2,0.88 23.27,0.88 21.62,2.53 COMP_SIGNALS1:I2C_IO:R6.A
COMP_SIGNALS1:N$7
  Bottom 0.508: COMP_SIGNALS1:I2C_IO:IC1.26 74.78,2.69 74.78,3.52 70.48,7.81 35.32,7.81 34.82,8.31 29.87,8.31 COMP_SIGNALS1:DUAL_12V⇆3V3_1BIT2:3V3_TO_12_1BIT1:U1.2
COMP_SIGNALS1:N$8
  Bottom 0.508: COMP_SIGNALS1:DUAL_12V⇆3V3_1BIT2:12V_TO_3V3_1BIT1:K3.5 11.54,3.19 12.04,3.68 29.54,3.68 30.53,2.69 31.69,2.69 COMP_SIGNALS1:I2C_IO:R5.A 32.02,2.53 34.99,5.5 71.81,5.5 72.3,5 72.3,2.69 COMP_SIGNALS1:I2C_IO:IC1.25
COMP_SIGNALS1:N$9
  Top 0.508: COMP_SIGNALS1:I2C_IO:IC1.24 69.99,2.69 69.99,4.34 73.29,7.64 86.17,7.64 86.83,8.31 COMP_SIGNALS1:DUAL_12V⇆3V3_1BIT1:3V3_TO_12_1BIT1:U1.2
COMP_SIGNALS1:N$10
  Bottom 0.508: COMP_SIGNALS1:I2C_IO:IC1.23 67.35,2.53 67.68,2.53 69.33,0.88 87.16,0.88 88.81,2.53 COMP_SIGNALS1:I2C_IO:R4.A 89.14,2.53 90.3,1.37 100.7,1.37 102.35,3.02 107.96,3.02 COMP_SIGNALS1:DUAL_12V⇆3V3_1BIT1:12V_TO_3V3_1BIT1:K3.5
COMP_SIGNALS1:N$11
  Top 0.508: COMP_SIGNALS1:I2C_IO:IC1.22 64.87,2.53 65.2,2.53 66.85,0.88 90.79,0.88 98.22,8.31 COMP_SIGNALS1:DUAL_12V⇆3V3_1BIT0:3V3_TO_12_1BIT1:U1.2
COMP_SIGNALS1:N$12  (via drill 0.25)
  Top 0.508: v71.48,4.84 86.33,4.84 90.13,8.64 96.57,8.64 97.89,9.96 98.88,9.96 100.2,8.64 100.2,4.51 | 100.2,4.51 100.2,2.69 COMP_SIGNALS1:I2C_IO:R3.A | 100.2,4.51 108.62,4.51 109.94,3.19 114.24,3.19 COMP_SIGNALS1:DUAL_12V⇆3V3_1BIT0:12V_TO_3V3_1BIT1:K3.5
  Bottom 0.508: v71.48,4.84 64.87,4.84 62.72,2.69 62.23,2.69 COMP_SIGNALS1:I2C_IO:IC1.21
COMP_SIGNALS1:N$13
  Bottom 0.508: COMP_SIGNALS1:I2C_IO:IC1.8 62.23,10.29 61.73,10.29 59.42,12.6 44.07,12.6 38.62,18.05 21.12,18.05 18.48,20.69 18.48,21.02 COMP_SIGNALS1:3V3_TO_12_1BIT7:U1.2
COMP_SIGNALS1:N$14
  Top 0.508: COMP_SIGNALS1:I2C_IO:IC1.7 64.71,10.29 64.71,10.62 57.94,17.39 38.46,17.39 34.82,21.02 29.87,21.02 COMP_SIGNALS1:3V3_TO_12_1BIT6:U1.2
COMP_SIGNALS1:N$15
  Top 0.508: COMP_SIGNALS1:I2C_IO:IC1.6 67.18,10.29 66.85,10.29 59.09,18.05 49.19,18.05 46.21,21.02 41.26,21.02 COMP_SIGNALS1:3V3_TO_12_1BIT5:U1.2
COMP_SIGNALS1:N$16
  Top 0.508: COMP_SIGNALS1:I2C_IO:IC1.5 69.83,10.29 69.33,10.29 58.6,21.02 52.82,21.02 COMP_SIGNALS1:3V3_TO_12_1BIT4:U1.2
COMP_SIGNALS1:N$17
  Top 0.508: COMP_SIGNALS1:I2C_IO:IC1.4 72.3,10.29 72.3,12.6 64.21,20.69 64.21,21.02 COMP_SIGNALS1:3V3_TO_12_1BIT3:U1.2
COMP_SIGNALS1:N$18
  Top 0.508: COMP_SIGNALS1:I2C_IO:IC1.3 74.94,10.29 74.94,20.52 75.44,21.02 COMP_SIGNALS1:3V3_TO_12_1BIT2:U1.2
COMP_SIGNALS1:N$19
  Top 0.508: COMP_SIGNALS1:I2C_IO:IC1.2 77.58,10.29 77.58,11.77 86.83,21.02 COMP_SIGNALS1:3V3_TO_12_1BIT1:U1.2
COMP_SIGNALS1:N$20
  Top 0.508: COMP_SIGNALS1:I2C_IO:IC1.1 80.06,10.29 82.04,10.29 89.8,18.05 95.25,18.05 98.22,21.02 COMP_SIGNALS1:3V3_TO_12_1BIT0:U1.2
D0
  Top 0.508: COMP_SIGNALS1:LED8.A 110.44,109.18 110.11,109.18 101.52,100.6 99.05,100.6 97.56,99.11 REGISTER_B:ENABLE_DATA:K1.44 | REGISTER_A:ENABLE_DATA:K1.44 97.56,62.13 97.56,57.84 111.43,43.97 111.43,35.71 110.44,34.72 110.44,33.07 COMP_SIGNALS1:DUAL_12V⇆3V3_1BIT0:12V_TO_3V3_1BIT1:D5.C 114.24,29.27 114.24,28.45 COMP_SIGNALS1:DUAL_12V⇆3V3_1BIT0:12V_TO_3V3_1BIT1:K3.1 114.24,28.12 102.35,16.23 102.35,13.59 COMP_SIGNALS1:DUAL_12V⇆3V3_1BIT0:3V3_TO_12_1BIT1:U1.5
  Bottom 0.508: REGISTER_B:ENABLE_DATA:K1.44 97.56,98.95 102.35,94.16 102.51,94.16 103.34,93.33 103.34,78.47 99.05,74.18 99.05,63.78 97.56,62.29 REGISTER_A:ENABLE_DATA:K1.44
D1
  Top 0.508: COMP_SIGNALS1:DUAL_12V⇆3V3_1BIT1:3V3_TO_12_1BIT1:U1.5 90.96,13.59 93.76,13.59 101.52,21.35 102.84,21.35 107.96,26.47 107.96,28.28 COMP_SIGNALS1:DUAL_12V⇆3V3_1BIT1:12V_TO_3V3_1BIT1:K3.1
  Bottom 0.508: COMP_SIGNALS1:LED9.A 96.57,109.18 96.57,106.05 101.85,100.76 101.85,99.11 REGISTER_B:ENABLE_DATA:K1.34 102.02,98.95 102.02,95.64 104,93.66 104,64.44 102.02,62.46 REGISTER_A:ENABLE_DATA:K1.34 102.02,62.13 102.02,57.84 104.99,54.86 104.99,35.71 COMP_SIGNALS1:DUAL_12V⇆3V3_1BIT1:12V_TO_3V3_1BIT1:D5.C 105.16,35.55 106.48,34.23 106.48,31.09 107.96,29.6 107.96,28.45 COMP_SIGNALS1:DUAL_12V⇆3V3_1BIT1:12V_TO_3V3_1BIT1:K3.1
GND
  Top 0.635: COMP_SIGNALS1:LED8.K 110.44,111.82 96.74,111.82 COMP_SIGNALS1:LED9.K 96.41,111.82 85.34,111.82 REGISTER_B:LED2.K 85.01,111.82 68.67,111.82 REGISTER_B:LED3.K 68.34,111.66 54.47,111.66 53.15,110.34 50.67,110.34 49.35,111.66 12V_PWR_BLK:PWR.1 49.02,111.82 38.12,111.82 12V_PWR_BLK:C1.2 37.79,111.82 36.47,113.14 32.02,113.14 30.7,111.82 19.3,111.82 COMP_SIGNALS1:LED10.K 18.97,111.82 6.43,111.82 COMP_SIGNALS1:LED11.K | REGISTER_B:C1.2 15.84,75.01 20.3,75.01 REGISTER_B:ENABLE_ADDRESS:D2.C 20.46,75.17 21.95,76.66 21.95,84.75 | 21.95,84.75 20.79,84.75 19.3,86.23 REGISTER_B:ENABLE_ADDRESS:K1.A1 | 21.95,84.75 29.04,84.75 REGISTER_B:K1.2 29.21,84.42 34.16,79.46 34.16,77.81 | 34.16,77.81 34.16,76.33 REGISTER_B:D2.C | 109.28,75.01 111.76,75.01 REGISTER_B:ENABLE_DATA:D2.C | 109.28,75.01 107.3,75.01 REGISTER_B:C2.2 106.97,75.17 104.33,75.17 103.17,76.33 98.55,76.33 98.39,76.16 90.3,76.16 89.14,77.32 REGISTER_B:D10.C | REGISTER_B:D10.C 88.81,77.32 86.5,75.01 85.18,75.01 REGISTER_A:LED2.K 84.85,75.01 74.94,75.01 72.63,77.32 REGISTER_B:D8.C 72.3,77.32 69.99,75.01 68.67,75.01 REGISTER_A:LED3.K | REGISTER_B:K5.2 83.86,84.58 83.86,82.6 88.81,77.65 REGISTER_B:D10.C | 54.8,84.75 54.8,78.97 52.16,76.33 REGISTER_B:D4.C 51.83,76.33 50.34,77.81 34.16,77.81 | 54.8,84.75 54.8,86.23 REGISTER_B:K2.A1 | 54.8,84.75 67.18,84.75 REGISTER_B:K4.2 | COMP_SIGNALS1:I2C_IO:R4.C 86.5,2.69 86.83,2.69 90.79,6.65 COMP_SIGNALS1:DUAL_12V⇆3V3_1BIT1:3V3_TO_12_1BIT1:U1.1 | REGISTER_A:K2.A1 54.8,49.42 54.8,40.66 53.64,39.51 REGISTER_A:D4.C 53.48,39.34 55.79,37.03 55.79,33.07 COMP_SIGNALS1:LED4.K 56.12,33.07 67.02,33.07 COMP_SIGNALS1:LED3.K 67.35,33.07 67.35,34.39 72.3,39.34 REGISTER_A:D8.C
  Top 0.635: REGISTER_A:D8.C 72.63,39.18 78.74,33.07 COMP_SIGNALS1:LED2.K 78.91,33.24 89.97,33.24 COMP_SIGNALS1:LED1.K | REGISTER_A:K4.2 67.35,47.76 67.35,47.1 72.3,42.15 72.3,39.67 REGISTER_A:D8.C | COMP_SIGNALS1:LED1.K 90.13,33.07 90.13,38.19 88.98,39.34 REGISTER_A:D10.C 88.81,39.67 88.81,40.83 83.86,45.78 83.86,47.76 REGISTER_A:K5.2 | COMP_SIGNALS1:LED0.K 101.69,33.07 101.69,38.02 REGISTER_A:C2.2 | COMP_SIGNALS1:DUAL_12V⇆3V3_1BIT1:12V_TO_3V3_1BIT1:D6.C 103.01,31.75 101.85,32.91 COMP_SIGNALS1:LED0.K | COMP_SIGNALS1:LED1.K 90.46,33.07 101.36,33.07 COMP_SIGNALS1:LED0.K | REGISTER_A:D2.C 35.48,39.34 33.17,37.03 33.17,33.07 COMP_SIGNALS1:LED6.K 33.5,33.07 44.4,33.07 COMP_SIGNALS1:LED5.K | 8.41,24.49 11.38,24.49 COMP_SIGNALS1:DUAL_12V⇆3V3_1BIT2:12V_TO_3V3_1BIT1:K3.2 11.71,24.32 13.03,24.32 17.82,19.53 22.11,19.53 COMP_SIGNALS1:3V3_TO_12_1BIT7:U1.1 | 8.41,24.49 5.27,24.49 COMP_SIGNALS1:DUAL_12V⇆3V3_1BIT3:12V_TO_3V3_1BIT1:K3.2 | COMP_SIGNALS1:DUAL_12V⇆3V3_1BIT2:12V_TO_3V3_1BIT1:D6.C COMP_SIGNALS1:DUAL_12V⇆3V3_1BIT3:12V_TO_3V3_1BIT1:D6.C | 8.41,24.49 8.41,31.58 COMP_SIGNALS1:DUAL_12V⇆3V3_1BIT2:12V_TO_3V3_1BIT1:D6.C | REGISTER_A:ENABLE_ADDRESS:D2.C 24.09,38.19 20.46,38.19 REGISTER_A:C1.2 20.3,38.02 20.3,33.07 COMP_SIGNALS1:LED7.K 19.96,33.07 18.64,31.75 COMP_SIGNALS1:DUAL_12V⇆3V3_1BIT2:12V_TO_3V3_1BIT1:D6.C | COMP_SIGNALS1:I2C_IO:R6.C 19.14,2.69 19.14,3.68 22.11,6.65 COMP_SIGNALS1:DUAL_12V⇆3V3_1BIT3:3V3_TO_12_1BIT1:U1.1 22.61,6.82 25.08,6.82 29.04,2.86 COMP_SIGNALS1:I2C_IO:R5.C 29.21,2.69 29.71,2.69 31.52,4.51 | 31.52,4.51 33.67,6.65 COMP_SIGNALS1:DUAL_12V⇆3V3_1BIT2:3V3_TO_12_1BIT1:U1.1 34,6.82 37.46,6.82 42.25,11.61 43.08,11.61 COMP_SIGNALS1:I2C_IO:C1.2 44.44,11.68 47.55,14.8 53.79,14.8 54.66,13.92 57.11,13.92
  Top 0.635: 57.11,13.92 57.11,10.29 COMP_SIGNALS1:I2C_IO:IC1.10 52.16,5.17 52.16,2.86 COMP_SIGNALS1:I2C_IO:IC1.17 51.99,2.53 49.68,2.53 COMP_SIGNALS1:I2C_IO:IC1.16 49.52,2.53 47.04,2.53 COMP_SIGNALS1:I2C_IO:IC1.15 46.71,2.69 45.55,3.85 42.58,3.85 41.43,2.69 40.77,2.69 COMP_SIGNALS1:I2C_IO:SV1.2 40.44,2.36 39.28,1.21 34.82,1.21 31.52,4.51 | 57.11,13.92 COMP_SIGNALS1:I2C_IO:C2.C | 109.28,75.01 109.28,50.9 110.6,49.58 REGISTER_A:ENABLE_DATA:K1.A1
  Bottom 0.635: REGISTER_B:ENABLE_DATA:D2.C 111.76,75.01 110.11,76.66 110.11,77.98 110.6,78.47 110.6,86.23 REGISTER_B:ENABLE_DATA:K1.A1 110.6,86.56 109.28,87.88 109.28,109.68 110.44,110.83 110.44,111.66 COMP_SIGNALS1:LED8.K | REGISTER_B:K4.2 67.35,84.58 67.35,82.6 72.47,77.48 REGISTER_B:D8.C | COMP_SIGNALS1:DUAL_12V⇆3V3_1BIT1:3V3_TO_12_1BIT1:U1.1 90.96,6.65 93.6,6.65 97.56,2.69 COMP_SIGNALS1:I2C_IO:R3.C 97.89,2.69 98.22,2.69 102.18,6.65 COMP_SIGNALS1:DUAL_12V⇆3V3_1BIT0:3V3_TO_12_1BIT1:U1.1 102.35,6.99 102.35,8.14 103.83,9.63 103.83,17.88 102.51,19.2 COMP_SIGNALS1:3V3_TO_12_1BIT0:U1.1 | 109.28,24.49 114.24,24.49 COMP_SIGNALS1:DUAL_12V⇆3V3_1BIT0:12V_TO_3V3_1BIT1:K3.2 | 109.28,24.49 108.13,24.49 COMP_SIGNALS1:DUAL_12V⇆3V3_1BIT1:12V_TO_3V3_1BIT1:K3.2 107.8,24.32 107.3,24.32 102.51,19.53 COMP_SIGNALS1:3V3_TO_12_1BIT0:U1.1 | COMP_SIGNALS1:3V3_TO_12_1BIT1:U1.1 90.96,19.53 102.18,19.53 COMP_SIGNALS1:3V3_TO_12_1BIT0:U1.1 | 110.94,39.18 REGISTER_A:ENABLE_DATA:D2.C 109.78,37.86 109.78,33.9 107.96,32.08 107.96,31.75 COMP_SIGNALS1:DUAL_12V⇆3V3_1BIT1:12V_TO_3V3_1BIT1:D6.C 108.13,31.58 109.28,30.43 109.28,24.49 | 110.94,39.18 111.43,39.67 111.43,41.33 110.77,41.99 110.77,49.42 REGISTER_A:ENABLE_DATA:K1.A1 | 110.94,39.18 COMP_SIGNALS1:DUAL_12V⇆3V3_1BIT0:12V_TO_3V3_1BIT1:D6.C | REGISTER_A:K1.2 29.21,47.76 29.21,45.78 35.48,39.51 REGISTER_A:D2.C | REGISTER_A:ENABLE_ADDRESS:K1.A1 19.3,49.42 19.3,39.01 20.13,38.19 REGISTER_A:C1.2 | COMP_SIGNALS1:LED6.K 33.01,33.07 29.21,33.07 24.26,38.02 REGISTER_A:ENABLE_ADDRESS:D2.C | COMP_SIGNALS1:3V3_TO_12_1BIT7:U1.1 22.28,19.53 33.67,19.53 COMP_SIGNALS1:3V3_TO_12_1BIT6:U1.1 34,19.53 45.06,19.53 COMP_SIGNALS1:3V3_TO_12_1BIT5:U1.1 45.39,19.53 56.29,19.53 COMP_SIGNALS1:3V3_TO_12_1BIT4:U1.1
  Bottom 0.635: COMP_SIGNALS1:3V3_TO_12_1BIT4:U1.1 56.62,19.37 56.62,14.58 57.11,14.08 COMP_SIGNALS1:I2C_IO:C2.C | COMP_SIGNALS1:3V3_TO_12_1BIT4:U1.1 56.78,19.53 67.84,19.53 COMP_SIGNALS1:3V3_TO_12_1BIT3:U1.1 68.17,19.53 77.58,19.53 | 77.58,19.53 79.4,19.53 COMP_SIGNALS1:3V3_TO_12_1BIT2:U1.1 | COMP_SIGNALS1:LED2.K 78.74,32.08 77.58,30.92 77.58,19.53
R0_LOADA
  Top 0.508: 78.74,29.44 78.74,26.96 79.4,26.3 COMP_SIGNALS1:3V3_TO_12_1BIT2:U1.5 | 78.74,29.44 COMP_SIGNALS1:LED2.A | 29.04,40.83 29.04,40.5 28.05,39.51 REGISTER_A:D1.C | 29.04,40.83 29.04,43.97 REGISTER_A:K1.1 | 78.74,29.44 58.27,29.44 57.61,30.1 56.95,30.1 56.29,29.44 49.52,29.44 38.12,40.83 29.04,40.83
R0_LOADD
  Top 0.508: COMP_SIGNALS1:3V3_TO_12_1BIT1:U1.5 90.79,26.3 90.3,26.8 90.3,30.43 COMP_SIGNALS1:LED1.A 89.97,30.59 80.23,30.59 78.91,31.92 51.83,31.92 44.56,39.18 REGISTER_A:D3.C 44.4,39.51 44.4,46.77 41.76,49.42 REGISTER_A:K2.A2
R0_SELECTA
  Top 0.508: REGISTER_A:C1.1 15.18,38.19 7.25,38.19 REGISTER_A:ENABLE_ADDRESS:D1.C 7.09,38.35 5.93,39.51 5.93,41.16 6.1,41.33 6.1,49.42 REGISTER_A:ENABLE_ADDRESS:K1.A2 6.26,49.58 14.02,57.34 16.5,57.34 28.38,69.23 29.04,69.23 REGISTER_A:K1.5
  Bottom 0.508: 67.35,28.78 67.35,26.8 67.84,26.3 COMP_SIGNALS1:3V3_TO_12_1BIT3:U1.5 | 67.35,28.78 67.35,30.43 COMP_SIGNALS1:LED3.A | 67.35,28.78 26.07,28.78 16.83,38.02 15.34,38.02 REGISTER_A:C1.1
R0_SELECTD
  Top 0.508: COMP_SIGNALS1:LED0.A 101.69,30.43 101.69,26.8 102.18,26.3 COMP_SIGNALS1:3V3_TO_12_1BIT0:U1.5 | REGISTER_A:ENABLE_DATA:D1.C 93.1,38.19 96.41,38.19 REGISTER_A:C2.1
  Bottom 0.508: REGISTER_A:K2.34 46.21,62.13 46.54,62.13 59.09,49.58 97.23,49.58 REGISTER_A:ENABLE_DATA:K1.A2 97.4,49.42 97.4,39.01 96.57,38.19 REGISTER_A:C2.1 96.57,37.86 96.57,36.54 101.52,31.58 101.52,30.59 COMP_SIGNALS1:LED0.A
R1_LOADA
  Top 0.508: COMP_SIGNALS1:LED6.A 33.17,30.43 33.17,26.8 33.67,26.3 COMP_SIGNALS1:3V3_TO_12_1BIT6:U1.5 | REGISTER_B:K1.1 29.04,80.79 29.04,78.64 26.73,76.33 REGISTER_B:D1.C
  Bottom 0.508: COMP_SIGNALS1:LED6.A 33.17,30.59 33.17,31.58 34.16,32.58 34.16,33.9 29.21,38.85 29.21,42.32 26.73,44.79 26.73,76.16 REGISTER_B:D1.C
R1_LOADD
  Top 0.508: COMP_SIGNALS1:LED5.A 44.56,30.43 44.56,26.8 45.06,26.3 COMP_SIGNALS1:3V3_TO_12_1BIT5:U1.5
  Bottom 0.508: REGISTER_B:K2.A2 41.76,86.23 44.4,83.59 44.4,76.33 REGISTER_B:D3.C 44.4,76 43.24,74.84 43.24,32.74 44.4,31.58 44.4,30.59 COMP_SIGNALS1:LED5.A
R1_SELECTA
  Top 0.508: COMP_SIGNALS1:LED7.A 20.46,30.43 20.46,27.95 22.11,26.3 COMP_SIGNALS1:3V3_TO_12_1BIT7:U1.5 | REGISTER_B:C1.1 10.72,75.01 6.43,75.01 REGISTER_B:ENABLE_ADDRESS:D1.C 6.26,75.17 5.1,76.33 5.1,77.98 6.1,78.97 6.1,86.23 REGISTER_B:ENABLE_ADDRESS:K1.A2
  Bottom 0.508: REGISTER_B:K1.5 29.04,106.05 28.38,106.05 16.5,94.16 14.02,94.16 6.26,86.4 REGISTER_B:ENABLE_ADDRESS:K1.A2 | COMP_SIGNALS1:LED7.A 20.3,30.59 12.04,38.85 12.04,73.69 10.88,74.84 REGISTER_B:C1.1
R1_SELECTD  (via drill 0.25)
  Top 0.508: v57.28,29.44 57.28,26.96 56.62,26.3 COMP_SIGNALS1:3V3_TO_12_1BIT4:U1.5 | REGISTER_B:ENABLE_DATA:D1.C 97.89,75.01 102.02,75.01 REGISTER_B:C2.1 | REGISTER_B:K2.34 46.21,99.11 48.53,99.11 51,101.59 65.7,101.59 66.69,102.58 80.23,102.58 96.41,86.4 97.4,86.4 REGISTER_B:ENABLE_DATA:K1.A2
  Bottom 0.508: v57.28,29.44 56.29,30.43 55.96,30.43 COMP_SIGNALS1:LED4.A 55.79,30.59 55.79,31.58 48.2,39.18 48.2,58 44.56,61.63 44.56,74.51 45.72,75.67 45.72,90.36 47.54,92.18 47.54,97.62 46.21,98.95 REGISTER_B:K2.34 | REGISTER_B:ENABLE_DATA:D1.C 97.73,75.01 97.73,75.83 96.57,76.99 96.57,85.41 97.4,86.23 REGISTER_B:ENABLE_DATA:K1.A2
REGISTER_A:D$1
  Top 0.508: REGISTER_A:D1.A 30.53,39.51 33.01,39.51 REGISTER_A:D2.A
REGISTER_A:D$2
  Top 0.508: REGISTER_A:D3.A 47.04,39.51 50.67,39.51 REGISTER_A:D4.A
REGISTER_A:D$4
  Top 0.508: REGISTER_A:D7.A 67.35,39.51 69.83,39.51 REGISTER_A:D8.A
REGISTER_A:D$5
  Top 0.508: REGISTER_A:D9.A 83.86,39.51 86.33,39.51 REGISTER_A:D10.A
REGISTER_A:ENABLE_ADDRESS:D$1
  Top 0.508: REGISTER_A:ENABLE_ADDRESS:D1.A 7.25,40.66 24.09,40.66 REGISTER_A:ENABLE_ADDRESS:D2.A
REGISTER_A:ENABLE_DATA:D$1
  Top 0.508: REGISTER_A:ENABLE_DATA:D1.A 93.1,40.66 109.78,40.66 REGISTER_A:ENABLE_DATA:D2.A
REGISTER_A:HOLD
  Top 0.508: REGISTER_A:K2.42 41.76,66.26 44.07,66.26 47.04,69.23 67.18,69.23 REGISTER_A:K4.5 67.35,69.23 83.69,69.23 REGISTER_A:K5.5
REGISTER_A:N$1
  Top 0.508: REGISTER_A:K2.41 41.59,56.02 32.35,56.02 29.21,59.16 REGISTER_A:K1.3
REGISTER_A:R0
  Top 0.508: REGISTER_A:D9.C 81.38,39.51 83.69,41.82 83.69,43.97 REGISTER_A:K5.1 83.69,44.3 83.69,44.79 82.54,45.95 82.54,48.42 92.44,58.33 | 85.18,65.59 85.18,72.37 REGISTER_A:LED2.A 84.85,72.37 83.69,73.52 24.59,73.52 15.84,64.77 15.34,64.77 6.59,56.02 6.26,56.02 REGISTER_A:ENABLE_ADDRESS:K1.41 | 85.18,65.59 83.86,64.28 REGISTER_A:K5.4 | 85.18,65.59 92.44,58.33 | 92.44,58.33 94.75,56.02 97.4,56.02 REGISTER_A:ENABLE_DATA:K1.41
REGISTER_A:R1
  Top 0.508: REGISTER_A:D7.C 64.87,39.51 67.18,41.82 67.18,43.97 REGISTER_A:K4.1 67.18,44.3 67.18,46.11 66.03,47.27 66.03,62.95 67.18,64.11 REGISTER_A:K4.4 | REGISTER_A:ENABLE_ADDRESS:K1.31 10.55,56.02 11.05,56.02 27.39,72.37 68.5,72.37 REGISTER_A:LED3.A
  Bottom 0.508: 68.67,65.59 68.67,72.37 REGISTER_A:LED3.A | 68.67,65.59 67.35,64.28 REGISTER_A:K4.4 | 68.67,65.59 71.48,62.79 92.61,62.79 99.38,56.02 101.85,56.02 REGISTER_A:ENABLE_DATA:K1.31
REGISTER_B:D$1
  Top 0.508: REGISTER_B:D1.A 29.21,76.33 31.69,76.33 REGISTER_B:D2.A
REGISTER_B:D$2
  Top 0.508: REGISTER_B:D3.A 47.04,76.33 49.52,76.33 REGISTER_B:D4.A
REGISTER_B:D$4
  Top 0.508: REGISTER_B:D7.A 67.35,77.48 69.83,77.48 REGISTER_B:D8.A
REGISTER_B:D$5
  Top 0.508: REGISTER_B:D9.A 83.86,77.48 86.33,77.48 REGISTER_B:D10.A
REGISTER_B:ENABLE_ADDRESS:D$1
  Top 0.508: REGISTER_B:ENABLE_ADDRESS:D1.A 6.43,77.48 20.3,77.48 REGISTER_B:ENABLE_ADDRESS:D2.A
REGISTER_B:ENABLE_DATA:D$1
  Top 0.508: REGISTER_B:ENABLE_DATA:D1.A 97.89,77.48 111.76,77.48 REGISTER_B:ENABLE_DATA:D2.A
REGISTER_B:HOLD
  Top 0.508: REGISTER_B:K2.42 41.76,103.07 44.07,103.07 47.04,106.05 67.18,106.05 REGISTER_B:K4.5 67.35,106.21 83.69,106.21 REGISTER_B:K5.5
REGISTER_B:N$1
  Top 0.508: REGISTER_B:K2.41 41.59,92.84 32.35,92.84 29.21,95.97 REGISTER_B:K1.3
REGISTER_B:R0
  Top 0.508: REGISTER_B:K5.1 83.69,80.79 83.69,79.79 81.38,77.48 REGISTER_B:D9.C | 85.18,102.41 85.18,107.53 | 85.18,107.53 85.18,109.18 REGISTER_B:LED2.A | 85.18,102.41 83.86,101.09 REGISTER_B:K5.4 | 85.18,107.53 33.5,107.53 27.56,101.59 15.34,101.59 6.59,92.84 6.26,92.84 REGISTER_B:ENABLE_ADDRESS:K1.41 | 85.18,102.41 94.75,92.84 97.4,92.84 REGISTER_B:ENABLE_DATA:K1.41
  Bottom 0.508: REGISTER_B:K5.1 83.86,80.95 85.67,80.95 97.4,92.67 REGISTER_B:ENABLE_DATA:K1.41
REGISTER_B:R1
  Top 0.508: REGISTER_B:D7.C 64.87,77.48 67.18,79.79 67.18,80.79 REGISTER_B:K4.1 67.35,81.12 67.35,83.1 68.5,84.25 68.5,93 63.88,97.62 | 63.88,97.62 17.82,97.62 13.03,92.84 10.55,92.84 REGISTER_B:ENABLE_ADDRESS:K1.31 | 63.88,97.62 67.18,100.93 REGISTER_B:K4.4
  Bottom 0.508: 68.67,102.41 68.67,109.18 REGISTER_B:LED3.A | 68.67,102.41 67.35,101.09 REGISTER_B:K4.4 | 68.67,102.41 71.48,99.61 92.61,99.61 99.38,92.84 101.85,92.84 REGISTER_B:ENABLE_DATA:K1.31

### Text on the board
tNames: GND | 12V | ADDR1 | ADDR0 | B1 | B0 | DATA1 | DATA0 | A1 | A0 | B-SelectA | B-LoadA | B-LoadD | B-SelectD | A-SelectA | A-LoadA | A-LoadD | A-SelectD | SDA | SCL | GND | 3.3V
bNames: Jake Karnes | 2-bit Register Board Rev A